# EAGLE design RAM (EAGLE 9.6.2)
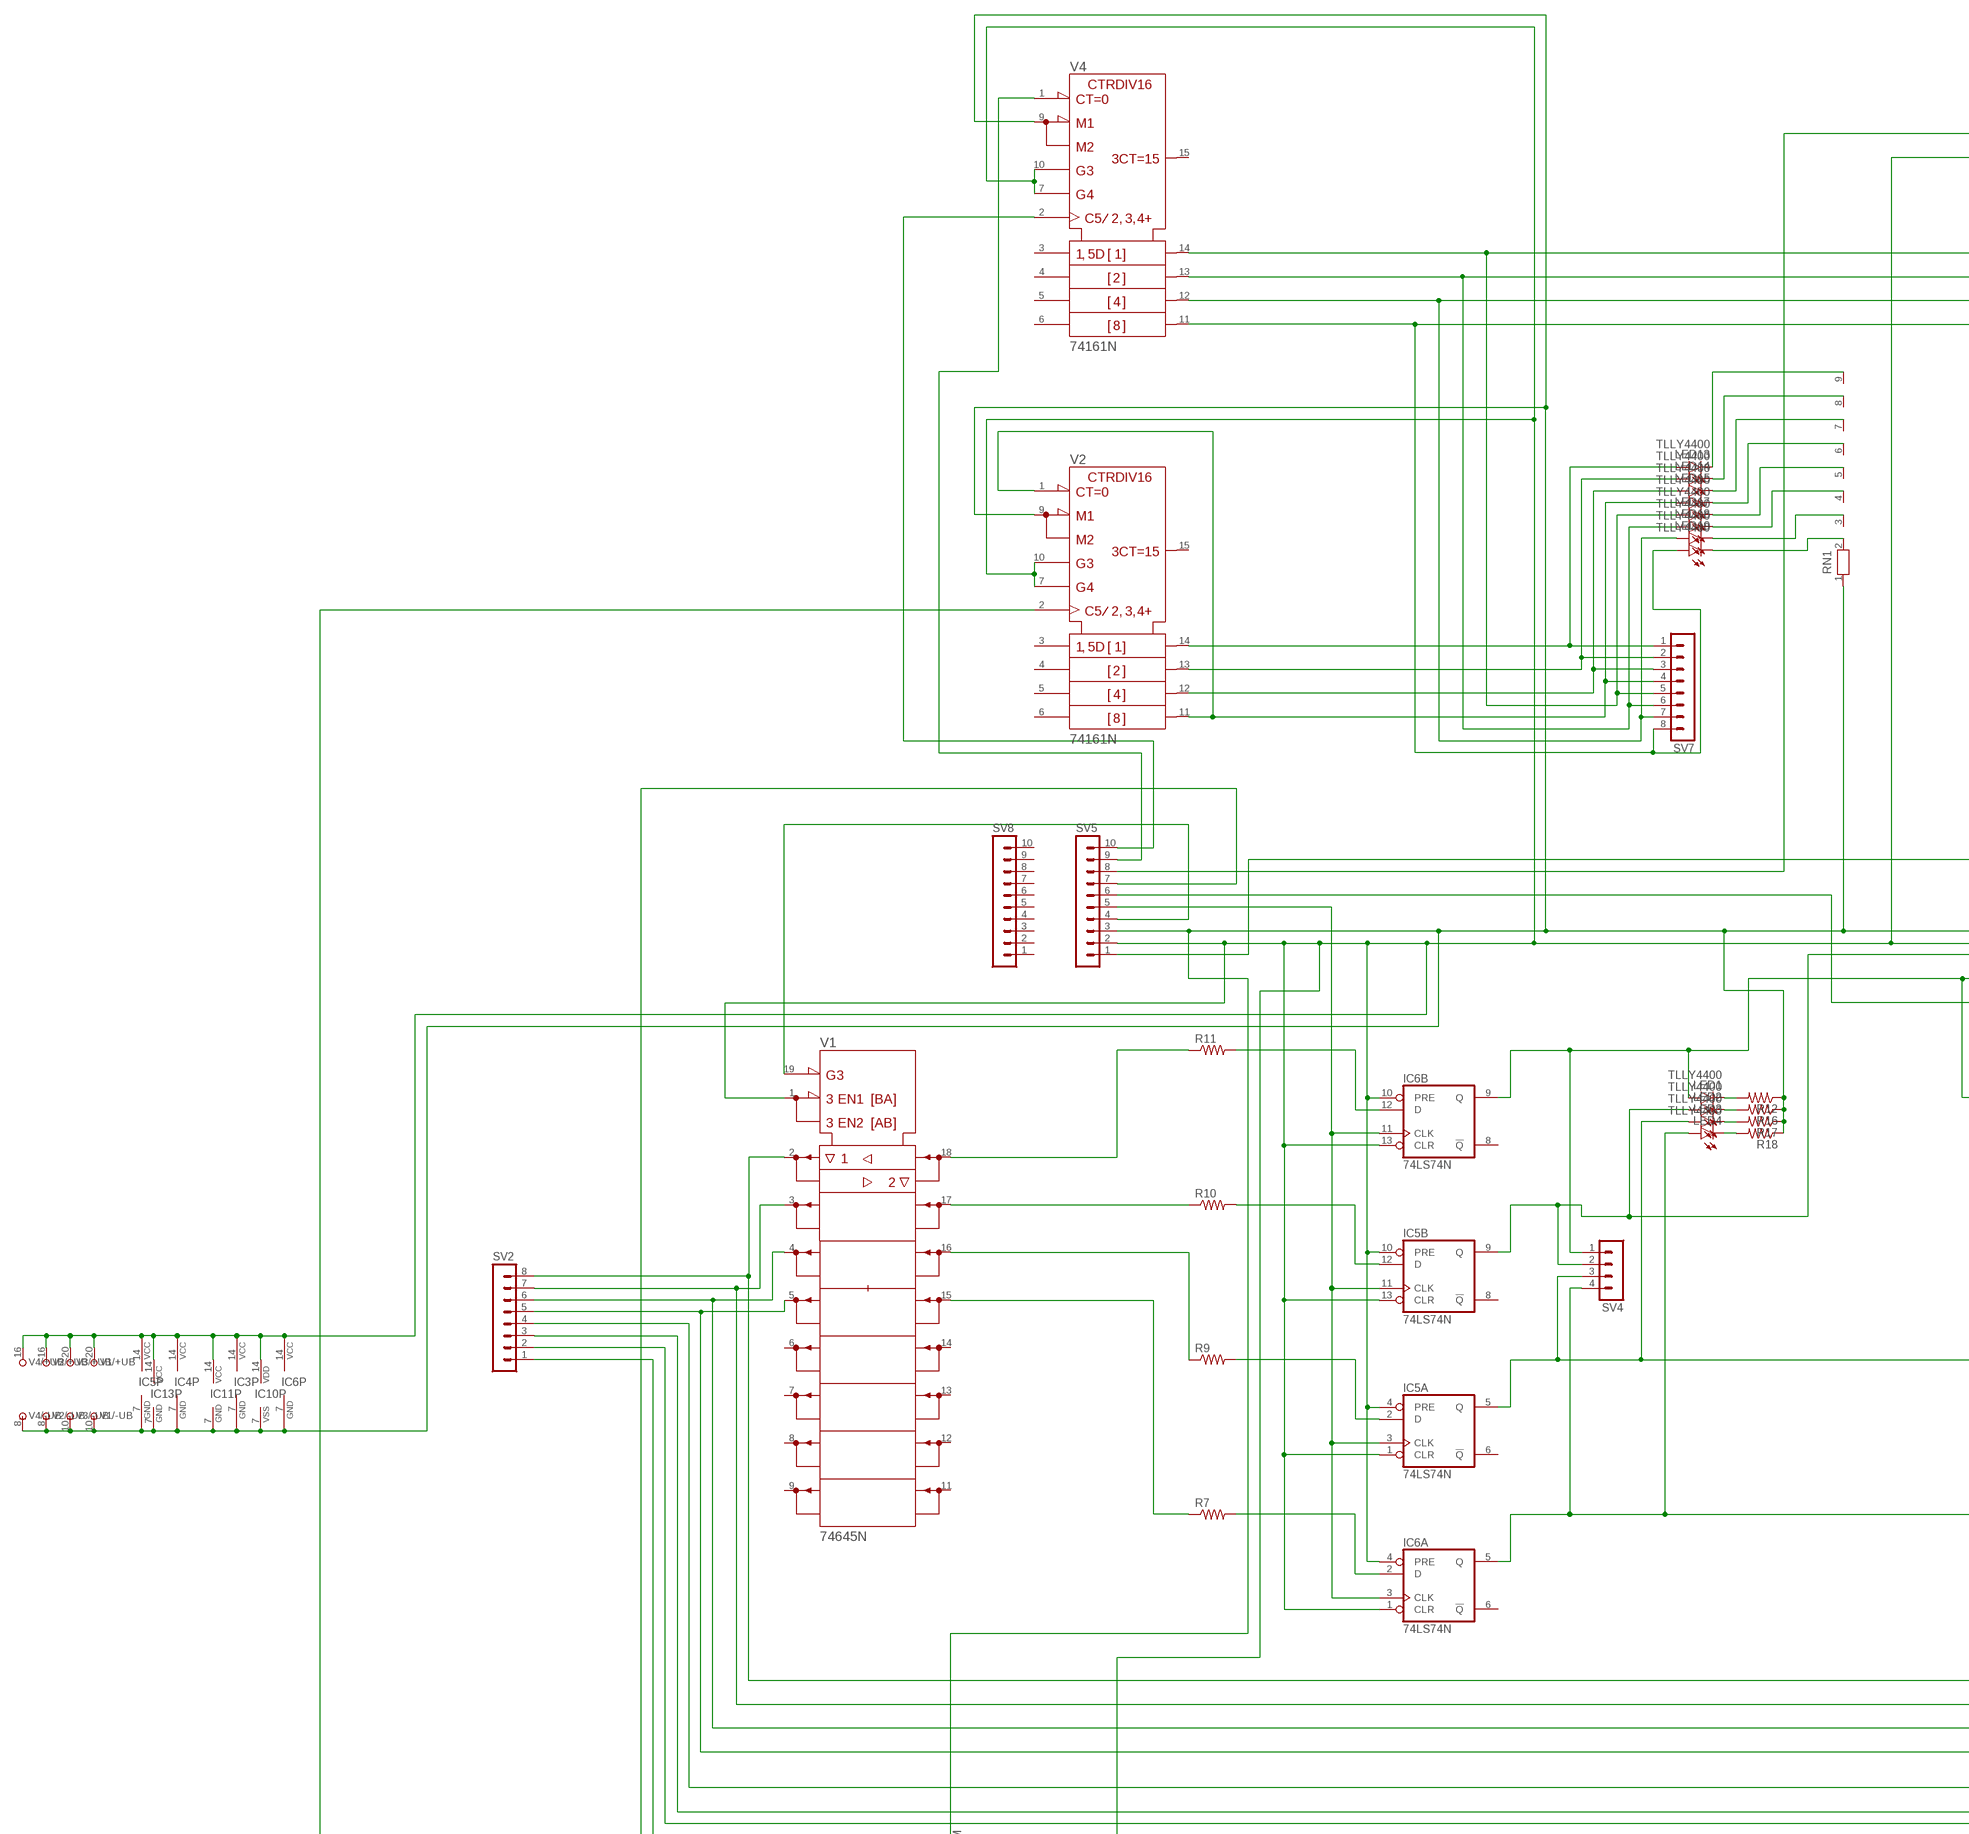
[diagram p0: schematic, sheet 1, part 1 of 3]
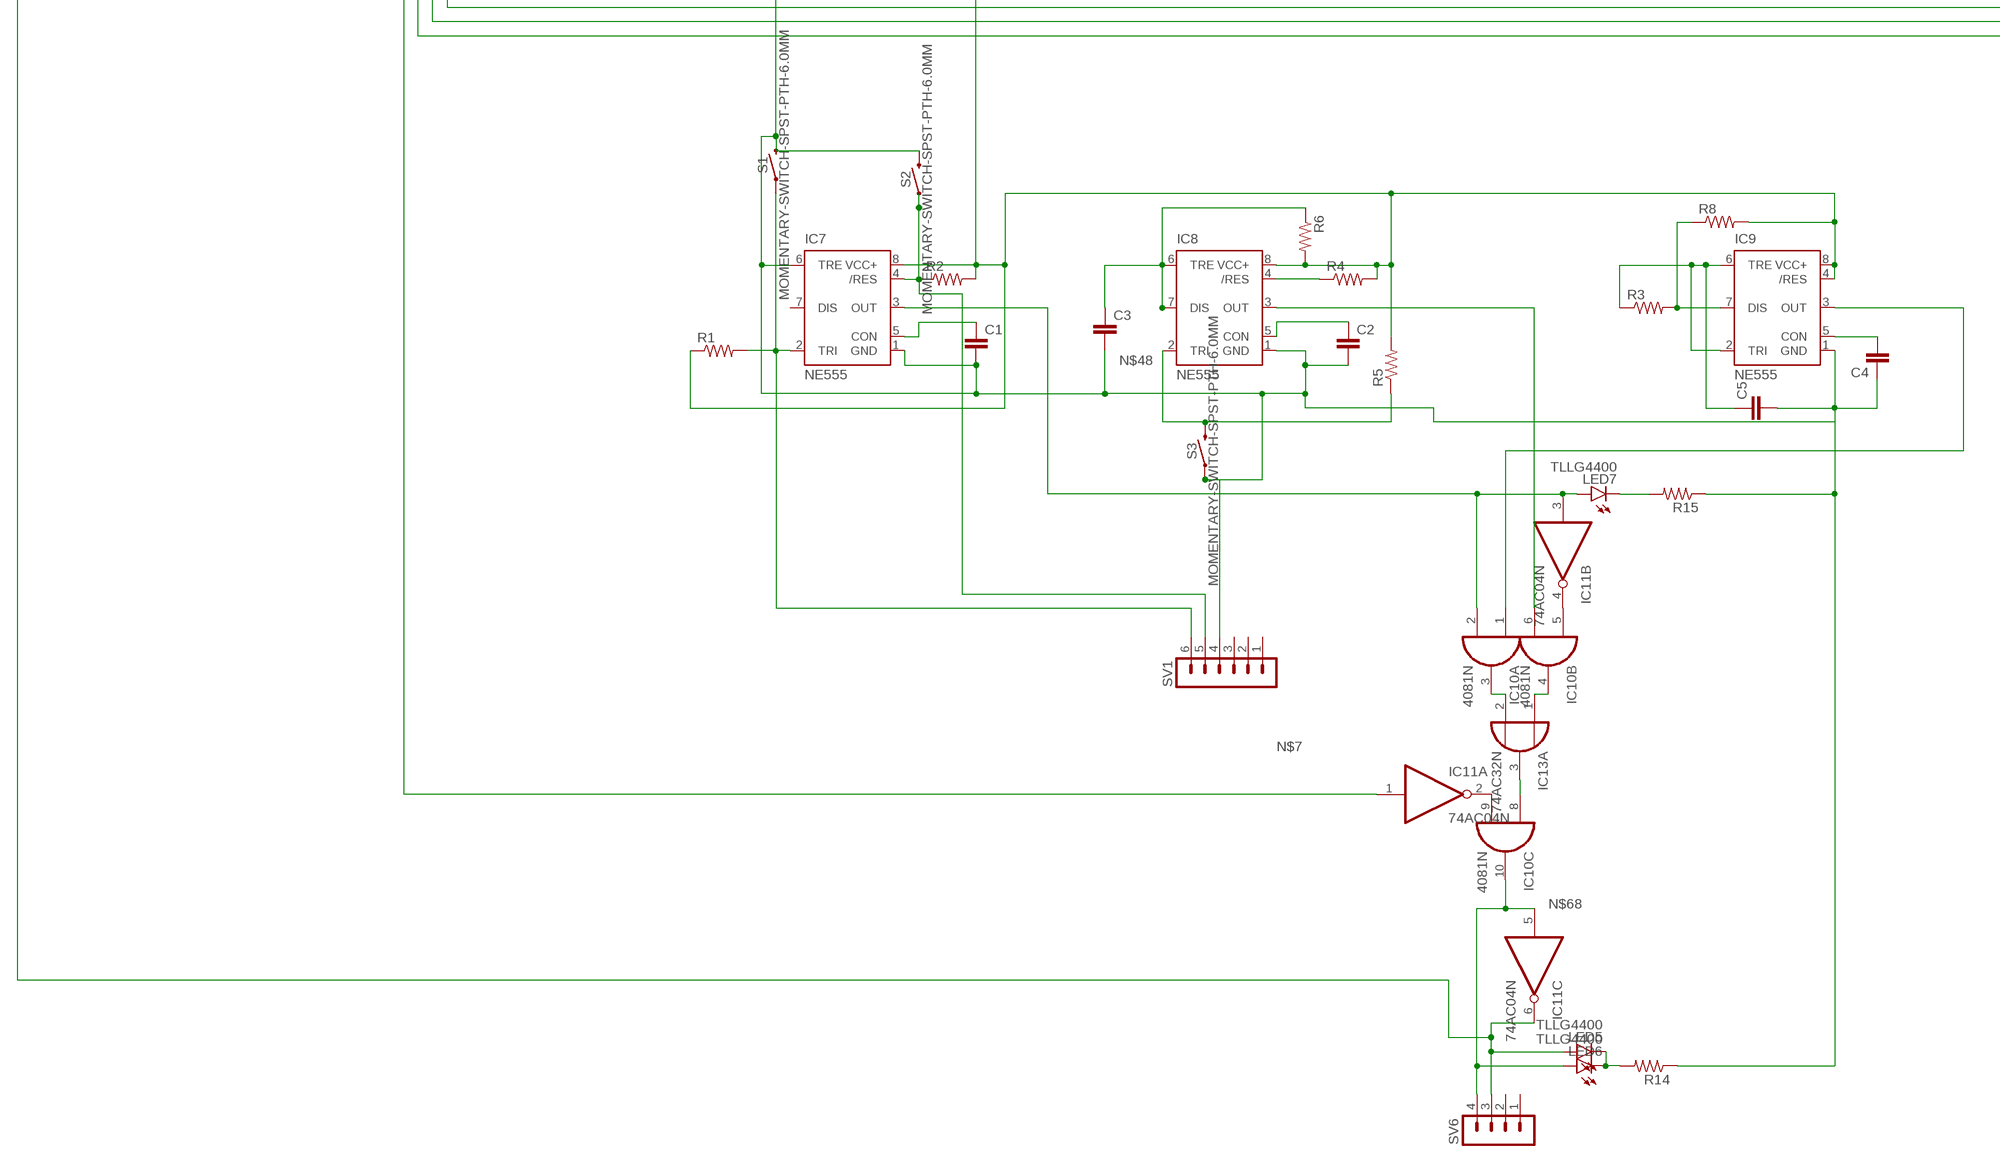
[diagram p1: schematic, sheet 1, part 2 of 3]
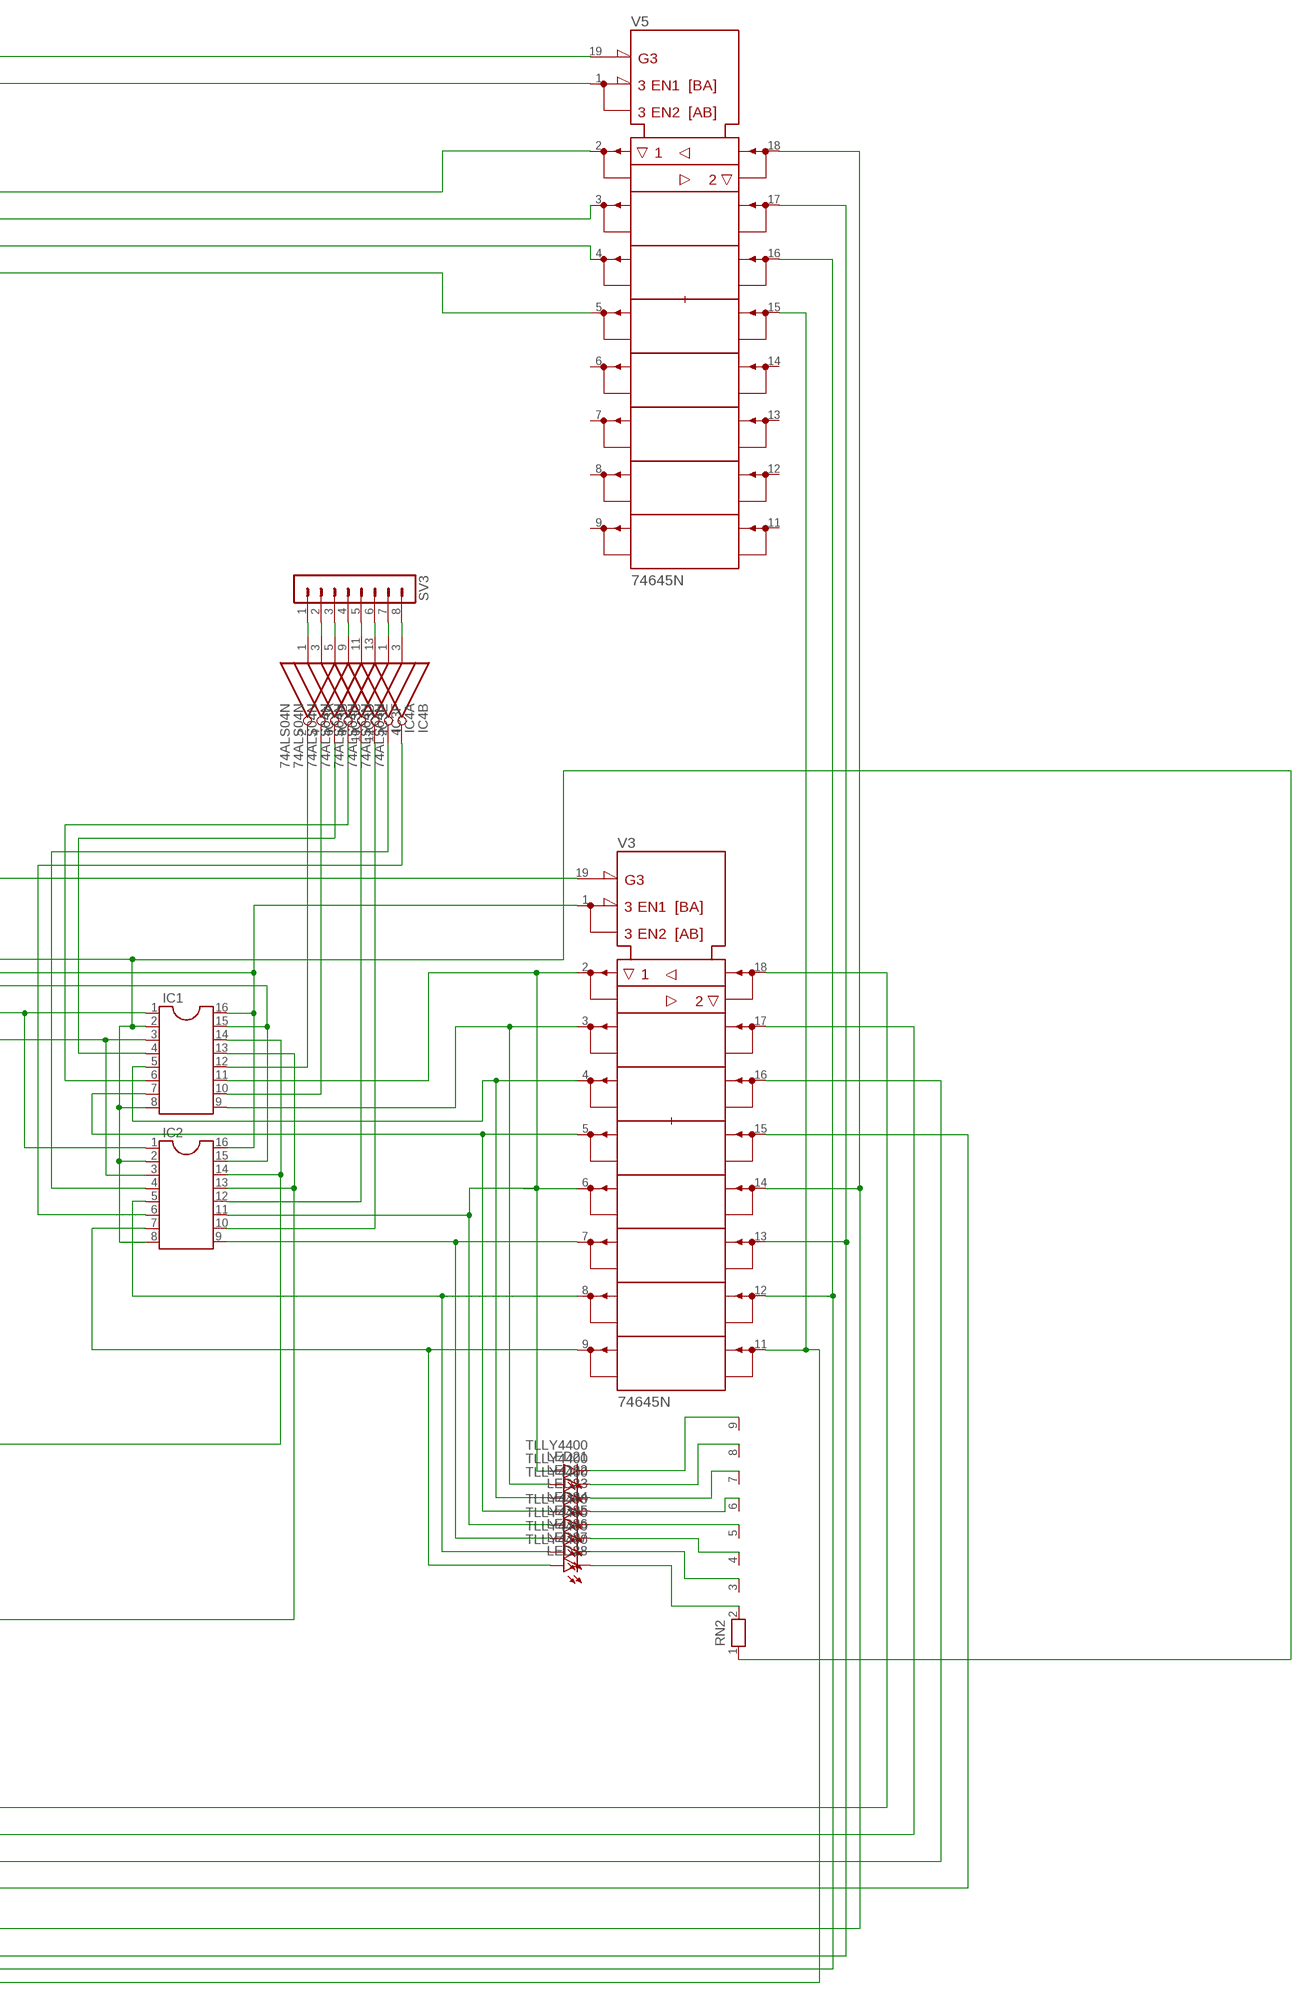
[diagram p2: schematic, sheet 1, part 3 of 3]

## Parts
C1  C2,5-3  [C2.5-3]
C2  C2,5-3  [C2.5-3]
C3  C2,5-3  [C2.5-3]
C4  C2,5-3  [C2.5-3]
C5  C2,5-3  [C2.5-3]
IC1  DIL16  [DIL16]
IC2  DIL16  [DIL16]
IC3  74ALS04N  [DIL14]
IC4  74ALS04N  [DIL14]
IC5  74LS74N  [DIL14]
IC6  74LS74N  [DIL14]
IC7  NE555  [DIL-08]
IC8  NE555  [DIL-08]
IC9  NE555  [DIL-08]
IC10  4081N  [DIL14]
IC11  74AC04N  [DIL14]
IC13  74AC32N  [DIL14]
LED1  TLLY4400  [LED3MM]
LED2  TLLY4400  [LED3MM]
LED3  TLLY4400  [LED3MM]
LED4  TLLY4400  [LED3MM]
LED5  TLLG4400  [LED3MM]
LED6  TLLG4400  [LED3MM]
LED7  TLLG4400  [LED3MM]
LED13  TLLY4400  [LED3MM]
LED14  TLLY4400  [LED3MM]
LED15  TLLY4400  [LED3MM]
LED16  TLLY4400  [LED3MM]
LED17  TLLY4400  [LED3MM]
LED18  TLLY4400  [LED3MM]
LED19  TLLY4400  [LED3MM]
LED20  TLLY4400  [LED3MM]
LED21  TLLY4400  [LED3MM]
LED22  TLLY4400  [LED3MM]
LED23  TLLY4400  [LED3MM]
LED24  TLLY4400  [LED3MM]
LED25  TLLY4400  [LED3MM]
LED26  TLLY4400  [LED3MM]
LED27  TLLY4400  [LED3MM]
LED28  TLLY4400  [LED3MM]
R1  R-US_0411/3V  [0411V]
R2  R-US_0411/3V  [0411V]
R3  R-US_0411/3V  [0411V]
R4  R-US_0411/3V  [0411V]
R5  R-US_0411/3V  [0411V]
R6  R-US_0411/3V  [0411V]
R7  R-US_0411/3V  [0411V]
R8  R-US_0411/3V  [0411V]
R9  R-US_0411/3V  [0411V]
R10  R-US_0411/3V  [0411V]
R11  R-US_0411/3V  [0411V]
R12  R-US_0411/3V  [0411V]
R14  R-US_0411/3V  [0411V]
R15  R-US_0411/3V  [0411V]
R16  R-US_0411/3V  [0411V]
R17  R-US_0411/3V  [0411V]
R18  R-US_0411/3V  [0411V]
RN1  RN08  [RN-9]
RN2  RN08  [RN-9]
S1  MOMENTARY-SWITCH-SPST-PTH-6.0MM  [TACTILE_SWITCH_PTH_6.0MM]
S2  MOMENTARY-SWITCH-SPST-PTH-6.0MM  [TACTILE_SWITCH_PTH_6.0MM]
S3  MOMENTARY-SWITCH-SPST-PTH-6.0MM  [TACTILE_SWITCH_PTH_6.0MM]
SV1  MA06-1  [MA06-1]
SV2  MA08-1  [MA08-1]
SV3  MA08-1  [MA08-1]
SV4  MA04-1  [MA04-1]
SV5  MA10-1  [MA10-1]
SV6  MA04-1  [MA04-1]
SV7  MA08-1  [MA08-1]
SV8  MA10-1  [MA10-1]
V1  74645N  [DIL20]
V2  74161N  [DIL16]
V3  74645N  [DIL20]
V4  74161N  [DIL16]
V5  74645N  [DIL20]

## Nets
N$1: LED28.K(C) RN2.2
N$2: IC1.10 IC3.4(B:O)
N$3: IC1.1 IC2.1 IC6.9(B:Q) LED1.A SV4.1
N$4: IC1.15 IC2.15 IC5.9(B:Q) LED2.A SV4.2
N$5: C1.1 IC7.5(CON)
N$6: LED19.A SV7.7 V4.12(QC) V5.4(A3)
N$7: IC11.1(A:I) SV5.7
N$8: IC7.2(TRI) R1.2 S1.1 SV1.6
N$9: IC1.4 IC3.6(C:O)
N$10: SV2.8 V1.2(A1) V3.18(B1)
N$11: IC1.3 IC2.3 SV5.6
N$12: IC1.5 LED23.A V3.4(A3)
N$13: IC1.7 LED24.A V3.5(A4)
N$14: IC2.4 IC4.2(A:O)
N$15: IC2.10 IC3.12(F:O)
N$16: IC2.5 LED27.A V3.8(A7)
N$17: IC2.7 LED28.A V3.9(A8)
N$18: IC1.11 IC2.11 LED21.A LED25.A V3.2(A1)
N$19: IC5.3(A:CLK) IC5.11(B:CLK) IC6.3(A:CLK) IC6.11(B:CLK) SV5.5
N$20: IC1.9 LED22.A V3.3(A2)
N$21: IC1.6 IC3.8(D:O)
N$22: R10.1 V1.17(B2)
N$23: IC2.12 IC3.10(E:O)
N$24: R11.1 V1.18(B1)
N$25: R7.1 V1.15(B4)
N$26: V3.6(A5)
N$27: IC6.12(B:D) R11.2
N$28: IC1.13 IC2.13 IC6.5(A:Q) LED4.A SV4.4
N$29: IC2.6 IC4.4(B:O)
N$30: LED18.K(C) RN1.4
N$31: LED20.K(C) RN1.2
N$32: SV5.1 V3.19(!G)
N$33: IC3.1(A:I) SV3.1
N$34: IC3.3(B:I) SV3.2
N$35: IC3.5(C:I) SV3.3
N$36: IC3.9(D:I) SV3.4
N$37: IC3.11(E:I) SV3.5
N$38: C1.2 C2.2 C3.2 C4.1 C5.2 IC1.2 IC1.8 IC2.2 IC2.8 IC3.7(P:GND) IC4.7(P:GND) IC5.7(P:GND) IC6.7(P:GND) IC7.1(GND) IC7.6(TRE) IC8.1(GND) IC9.1(GND) IC10.7(P:VSS) IC11.7(P:GND) IC13.7(P:GND) R12.1 R14.1 R15.1 R16.1 R17.1 R18.1 RN1.1 RN2.1 S1.3 S2.3 S3.1 SV1.4 SV5.3 V1.10(-UB) V2.8(-UB) V2.9(!LOAD) V3.10(-UB) V4.8(-UB) V4.9(!LOAD)
N$39: IC3.13(F:I) SV3.6
N$40: C3.1 IC8.6(TRE) IC8.7(DIS) R6.1
N$41: IC4.1(A:I) SV3.7
N$42: IC4.3(B:I) SV3.8
N$43: IC7.4(/RES) R2.1 S2.1 SV1.5
N$44: IC7.3(OUT) IC10.2(A:I1) IC11.3(B:I) LED7.A
N$45: C2.1 IC8.5(CON)
N$46: SV5.4 V1.19(!G)
N$47: IC10.4(B:O) IC13.1(A:I0)
N$48: IC8.2(TRI) R5.1 S3.3
N$49: R9.1 V1.16(B3)
N$50: SV2.1 V3.11(B8) V5.15(B4)
N$51: SV2.2 V3.12(B7) V5.16(B3)
N$52: SV2.3 V3.13(B6) V5.17(B2)
N$53: SV2.4 V3.14(B5) V5.18(B1)
N$54: LED18.A SV7.6 V4.13(QB) V5.3(A2)
N$55: LED20.A SV7.8 V4.11(QD) V5.5(A4)
N$56: LED17.A SV7.5 V4.14(QA) V5.2(A1)
N$57: SV5.8 V5.19(!G)
N$58: IC8.3(OUT) IC10.6(B:I1)
N$59: C5.1 IC9.2(TRI) IC9.6(TRE) R3.1
N$60: IC1.14 IC2.14 IC5.5(A:Q) LED3.A SV4.3
N$61: IC9.7(DIS) R3.2 R8.1
N$62: C4.2 IC9.5(CON)
N$63: LED5.K(C) LED6.K(C) R14.2
N$64: IC9.3(OUT) IC10.1(A:I0)
N$65: IC10.9(C:I1) IC11.2(A:O)
N$66: IC10.5(B:I0) IC11.4(B:O)
N$67: IC11.6(C:O) LED5.A SV6.3 V2.2(CLK)
N$68: IC10.10(C:O) IC11.5(C:I) LED6.A SV6.4
N$69: SV2.7 V1.3(A2) V3.17(B2)
N$70: LED13.A SV7.1 V2.14(QA)
N$71: LED14.A SV7.2 V2.13(QB)
N$72: LED15.A SV7.3 V2.12(QC)
N$73: LED16.A SV7.4 V2.1(!CLR) V2.11(QD)
N$74: IC10.8(C:I0) IC13.3(A:O)
N$75: SV2.6 V1.4(A3) V3.16(B3)
N$76: IC10.3(A:O) IC13.2(A:I1)
N$77: SV2.5 V1.5(A4) V3.15(B4)
N$78: IC1.16 IC2.16 IC3.14(P:VCC) IC4.14(P:VCC) IC5.1(A:CLR) IC5.4(A:PRE) IC5.10(B:PRE) IC5.13(B:CLR) IC5.14(P:VCC) IC6.1(A:CLR) IC6.4(A:PRE) IC6.10(B:PRE) IC6.13(B:CLR) IC6.14(P:VCC) IC7.8(VCC+) IC8.8(VCC+) IC9.4(/RES) IC9.8(VCC+) IC10.14(P:VDD) IC11.14(P:VCC) IC13.14(P:VCC) R1.1 R2.2 R4.2 R5.2 R6.2 R8.2 SV5.2 V1.1(DIR) V1.20(+UB) V2.7(ENP) V2.10(ENT) V2.16(+UB) V3.1(DIR) V3.20(+UB) V4.7(ENP) V4.10(ENT) V4.16(+UB) V5.1(DIR)
N$79: IC8.4(/RES) R4.1
N$80: LED19.K(C) RN1.3
N$81: SV5.9 V4.1(!CLR)
N$82: SV5.10 V4.2(CLK)
N$83: IC1.12 IC3.2(A:O)
N$84: IC2.9 LED26.A V3.7(A6)
N$85: LED17.K(C) RN1.5
N$86: LED16.K(C) RN1.6
N$87: LED15.K(C) RN1.7
N$88: LED14.K(C) RN1.8
N$89: LED13.K(C) RN1.9
N$90: LED7.K(C) R15.2
N$91: LED27.K(C) RN2.3
N$92: LED26.K(C) RN2.4
N$93: LED25.K(C) RN2.5
N$94: LED24.K(C) RN2.6
N$95: LED23.K(C) RN2.7
N$96: LED22.K(C) RN2.8
N$97: LED21.K(C) RN2.9
N$98: LED1.K(C) R12.2
N$99: LED2.K(C) R16.2
N$100: LED3.K(C) R17.2
N$101: LED4.K(C) R18.2
N$102: IC5.12(B:D) R10.2
N$103: IC5.2(A:D) R9.2
N$104: IC6.2(A:D) R7.2
Unconnected: IC4.5(C:I) IC4.6(C:O) IC4.8(D:O) IC4.9(D:I) IC4.10(E:O) IC4.11(E:I) IC4.12(F:O) IC4.13(F:I) IC5.6(A:!Q) IC5.8(B:!Q) IC6.6(A:!Q) IC6.8(B:!Q) IC7.7(DIS) IC10.11(D:O) IC10.12(D:I0) IC10.13(D:I1) IC11.8(D:O) IC11.9(D:I) IC11.10(E:O) IC11.11(E:I) IC11.12(F:O) IC11.13(F:I) IC13.4(B:I0) IC13.5(B:I1) IC13.6(B:O) IC13.8(C:O) IC13.9(C:I0) IC13.10(C:I1) IC13.11(D:O) IC13.12(D:I0) IC13.13(D:I1) SV1.1 SV1.2 SV1.3 SV6.1 SV6.2 SV8.1 SV8.2 SV8.3 SV8.4 SV8.5 SV8.6 SV8.7 SV8.8 SV8.9 SV8.10 V1.6(A5) V1.7(A6) V1.8(A7) V1.9(A8) V1.11(B8) V1.12(B7) V1.13(B6) V1.14(B5) V2.3(A) V2.4(B) V2.5(C) V2.6(D) V2.15(RCO) V4.3(A) V4.4(B) V4.5(C) V4.6(D) V4.15(RCO) V5.6(A5) V5.7(A6) V5.8(A7) V5.9(A8) V5.11(B8) V5.12(B7) V5.13(B6) V5.14(B5)

## Power pins joined to a net without a drawn wire
+UB: V5.20(+UB)
-UB: V5.10(-UB)

## Library data of the parts
C1-C5 = capacitor-wima:C: CAPACITOR naming: grid - package width
IC1 IC2 = ic-package:DIL16: Dual In Line / Socket
IC3 IC4 = 74xx-us:74*04: Hex INVERTER
IC5 IC6 = 74xx-us:74*74: Dual D type positive edge triggered FLIP FLOP, preset and clear
IC7-IC9 = st-microelectronics:NE555: General purpose bipolar Timer; MF: Arrow Electronics; MPN: NE555N; OC_FARNELL: 1467742; OC_NEWARK: 89K1486
IC10 = 40xx:4081: Quad 2-input AND
IC11 = 74xx-eu:74*04: Hex INVERTER
IC13 = 74xx-eu:74*32: Quad 2-input OR gate
LED1-LED4 LED13-LED28 = led:TLLY4400: Low Current (2mA) LED 3 mm Tinted Diffused Package color YELLOW Source: Data sheet <http://www.farnell.com/datasheets/391098.pdf>; MF: VISHAY SEMICONDUCTOR; OC_FARNELL: 1612439
LED5-LED7 = led:TLLG4400: Low Current (2mA) LED 3 mm Tinted Diffused Package color GREEN Source: Data sheet <http://www.farnell.com/datasheets/391098.pdf>; MF: VISHAY SEMICONDUCTOR; OC_FARNELL: 1612435
R1-R12 R14-R18 = rcl:R-US_: RESISTOR, American symbol; SPICEPREFIX: R
RN1 RN2 = resistor-net:RN08: RESISTOR NETWORK; OC_FARNELL: unknown; OC_NEWARK: unknown
S1-S3 = SparkFun-Switches:MOMENTARY-SWITCH-SPST: Momentary Switch (Pushbutton) - SPST Normally-open (NO) SPST momentary switches (buttons, pushbuttons). Variants PTH-12MM - 12mm square, through-hole Momentary Pushbutton Switch - 12mm Square <https://www.sparkfun.com/products/9190> (COM-09190) PTH-6.0MM, PTH-6.0MM-KIT - 6.0mm square, through-hole Mini Pushbutton Switch <https://www.sparkfun.com/products/97> (COM-00097) KIT package intended for soldering kit's - only one side of pads' copper is exposed. PTH-RIGHT-ANGLE-KIT - Right-angle, through-hole Right Angle Tactile Button <https://www.sparkfun.com/products/10791> - Used on SparkFun BigTime Watch Kit <https://www.sparkfun.com/products/11734> SMD-12MM - 12mm square, surface-mount Tactile Button - SMD (12mm) <https://www.sparkfun.com/products/12993> (COM-12993) Used on SparkFun PicoBoard <https://www.sparkfun.com/products/11888> SMD-4.5MM - 4.5mm Square Trackball Switch Used on SparkFun Blackberry Trackballer Breakout <https://www.sparkfun.com/products/13169> SMD-4.6MMX2.8MM - 4.60mm x 2.80mm, surface mount Used on SparkFun SAMD21 Mini Breakout <https://www.sparkfun.com/products/13664> SMD-5.2MM, SMD-5.2-REDUNDANT - 5.2mm square, surface-mount Mini Pushbutton Switch - SMD <https://www.sparkfun.com/products/8720> (COM-08720) Used on Arduino Pro Mini <https://www.sparkfun.com/products/11114> REDUNDANT package connects both switch circuits together SMD-6.0X3.5MM - 6.0 x 3.5mm, surface mount Momentary Reset Switch SMD <https://www.sparkfun.com/products/8229> (COM-08229) SMD-6.2MM-TALL - 6.2mm square, surface mount Tactile Button - SMD (6mm) <https://www.sparkfun.com/products/12992> Used on SparkFun Digital Sandbox <https://www.sparkfun.com/products/12651> SMD-RIGHT-ANGLE - Right-angle, surface mount Used on SparkFun Block for Intel® Edison - Arduino <https://www.sparkfun.com/products/13036>; PROD_ID: SWCH-08441; SF_SKU: COM-00097
SV1 = con-lstb:MA06-1: PIN HEADER; OC_FARNELL: unknown; OC_NEWARK: unknown
SV2 SV3 SV7 = con-lstb:MA08-1: PIN HEADER; OC_FARNELL: unknown; OC_NEWARK: unknown
SV4 SV6 = con-lstb:MA04-1: PIN HEADER; OC_FARNELL: unknown; OC_NEWARK: unknown
SV5 SV8 = con-lstb:MA10-1: PIN HEADER; OC_FARNELL: unknown; OC_NEWARK: unknown
V1 V3 V5 = 74ttl-din:74*645: Octal bus TRANSCEIVER 3-state
V2 V4 = 74ttl-din:74*161: Synchrounus 4-bit COUNTER

## Net classes
0 default: width 0.381 mm, drill 0.508 mm, clearance 0.254 mm

## Board
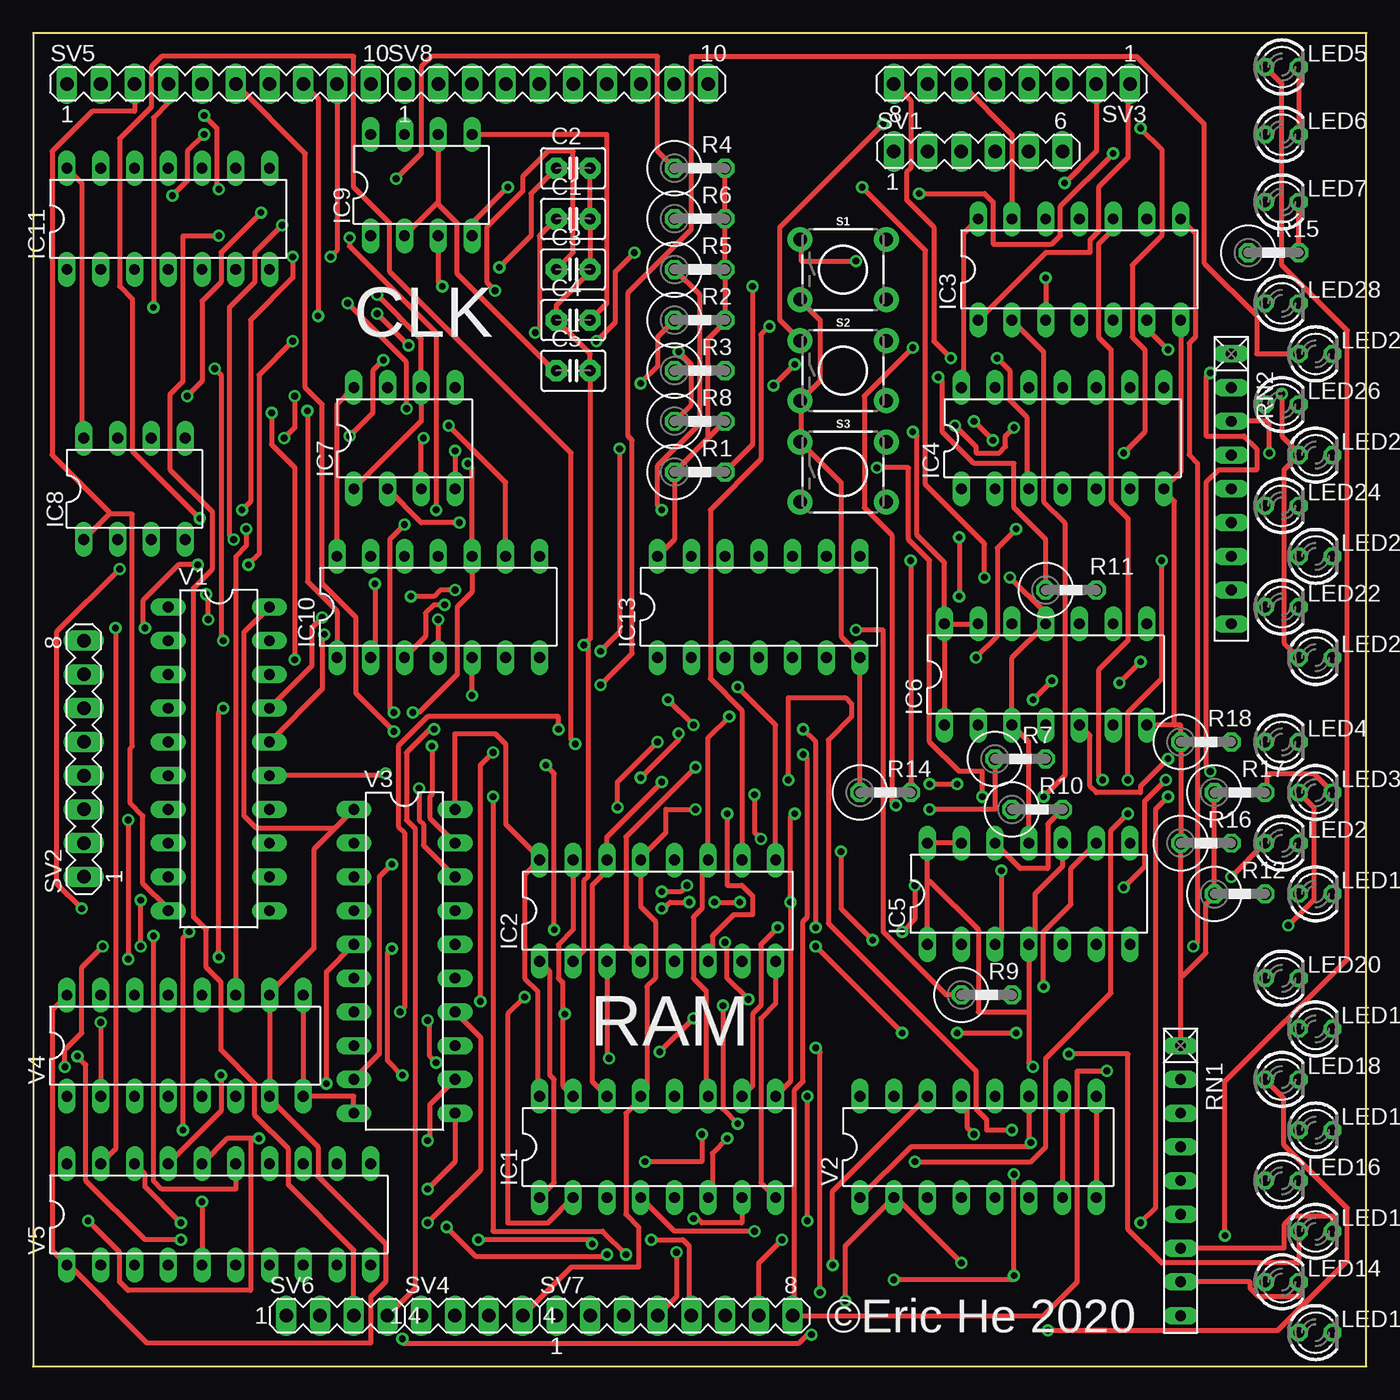
[diagram p3: board, top side]
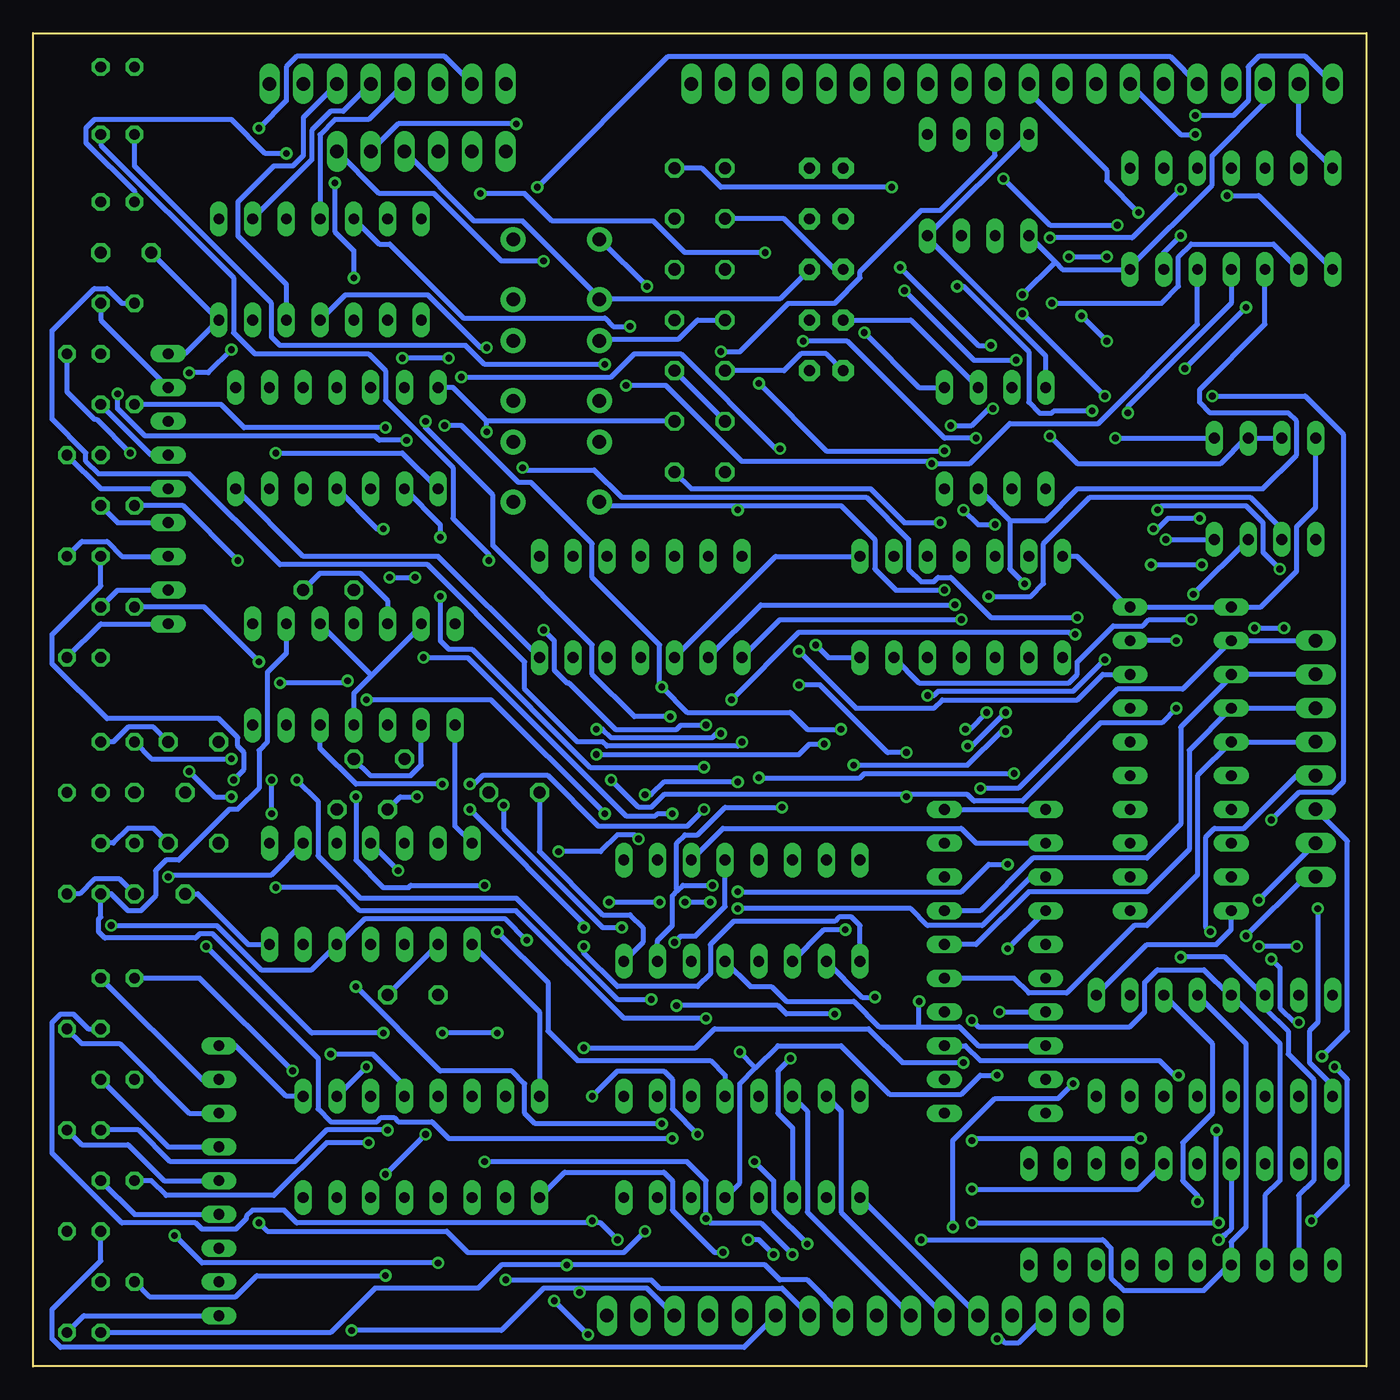
[diagram p4: board, bottom side, seen from below]

Size 100.33 x 100.33 mm. Coordinates in mm from the lower left corner, seen from the top.
Outline: 0,0 100.33,0 100.33,100.33 0,100.33 0,0
Copper layers (1*16): Top 0.035mm / dielectric 1.5mm / Bottom 0.035mm
Design rules "default": minimum track width 6mil, minimum drill 0.35mm, track to track 6mil, track to pad 6mil, pad to pad 6mil, via to via 6mil, smd to smd 6mil, copper to edge 40mil, drill to drill 6mil, minimum pad ring 10mil, minimum via ring 8mil, stop-mask expansion 4mil, vias tented up to drill 0mil, thermal gap 10mil

### Footprints (pad centres in the part's own frame; a part is rotated, then mirrored left to right if it is on the bottom)
C2.5-3 = drill 0.813 pad 1.6 octagon: 1 -1.27,0; 2 1.27,0
DIL16 = drill 0.813 long: 1 -8.89,-3.81; 2 -6.35,-3.81; 3 -3.81,-3.81; 4 -1.27,-3.81; 5 1.27,-3.81; 6 3.81,-3.81; 7 6.35,-3.81; 8 8.89,-3.81; 9 8.89,3.81; 10 6.35,3.81; 11 3.81,3.81; 12 1.27,3.81; 13 -1.27,3.81; 14 -3.81,3.81; 15 -6.35,3.81; 16 -8.89,3.81
DIL14 = drill 0.813 long: 1 -7.62,-3.81; 2 -5.08,-3.81; 3 -2.54,-3.81; 4 0,-3.81; 5 2.54,-3.81; 6 5.08,-3.81; 7 7.62,-3.81; 8 7.62,3.81; 9 5.08,3.81; 10 2.54,3.81; 11 0,3.81; 12 -2.54,3.81; 13 -5.08,3.81; 14 -7.62,3.81
DIL-08 = drill 0.813 long: 1 -3.81,-3.81; 2 -1.27,-3.81; 3 1.27,-3.81; 4 3.81,-3.81; 5 3.81,3.81; 6 1.27,3.81; 7 -1.27,3.81; 8 -3.81,3.81
LED3MM = drill 0.813 octagon: A -1.27,0; K 1.27,0
0411V = drill 0.914 octagon: 1 -2.54,0; 2 1.27,0
RN-9 = drill 0.813 long: 1 -10.16,0; 2 -7.62,0; 3 -5.08,0; 4 -2.54,0; 5 0,0; 6 2.54,0; 7 5.08,0; 8 7.62,0; 9 10.16,0
TACTILE_SWITCH_PTH_6.0MM = drill 1.016 pad 1.88: 1 -3.251,2.261; 2 3.251,2.261; 3 -3.251,-2.261; 4 3.251,-2.261
MA06-1 = drill 1.016 long: 1 -6.35,0; 2 -3.81,0; 3 -1.27,0; 4 1.27,0; 5 3.81,0; 6 6.35,0
MA08-1 = drill 1.016 long: 1 -8.89,0; 2 -6.35,0; 3 -3.81,0; 4 -1.27,0; 5 1.27,0; 6 3.81,0; 7 6.35,0; 8 8.89,0
MA04-1 = drill 1.016 long: 1 -3.81,0; 2 -1.27,0; 3 1.27,0; 4 3.81,0
MA10-1 = drill 1.016 long: 1 -11.43,0; 2 -8.89,0; 3 -6.35,0; 4 -3.81,0; 5 -1.27,0; 6 1.27,0; 7 3.81,0; 8 6.35,0; 9 8.89,0; 10 11.43,0
DIL20 = drill 0.813 long: 1 -11.43,-3.81; 2 -8.89,-3.81; 3 -6.35,-3.81; 4 -3.81,-3.81; 5 -1.27,-3.81; 6 1.27,-3.81; 7 3.81,-3.81; 8 6.35,-3.81; 9 8.89,-3.81; 10 11.43,-3.81; 11 11.43,3.81; 12 8.89,3.81; 13 6.35,3.81; 14 3.81,3.81; 15 1.27,3.81; 16 -1.27,3.81; 17 -3.81,3.81; 18 -6.35,3.81; 19 -8.89,3.81; 20 -11.43,3.81

### Placement (x,y rotation side)
C1  40.64,86.36 0 top
C2  40.64,90.17 0 top
C3  40.64,82.55 0 top
C4  40.64,78.74 0 top
C5  40.64,74.93 0 top
IC1  46.99,16.51 0 top
IC2  46.99,34.29 0 top
IC3  78.74,82.55 0 top
IC4  77.47,69.85 0 top
IC5  74.93,35.56 0 top
IC6  76.2,52.07 0 top
IC7  27.94,69.85 0 top
IC8  7.62,66.04 0 top
IC9  29.21,88.9 0 top
IC10  30.48,57.15 0 top
IC11  10.16,86.36 0 top
IC13  54.61,57.15 0 top
LED1  96.52,35.56 0 top
LED2  93.98,39.37 0 top
LED3  96.52,43.18 0 top
LED4  93.98,46.99 0 top
LED5  93.98,97.79 0 top
LED6  93.98,92.71 0 top
LED7  93.98,87.63 0 top
LED13  96.52,2.54 0 top
LED14  93.98,6.35 0 top
LED15  96.52,10.16 0 top
LED16  93.98,13.97 0 top
LED17  96.52,17.78 0 top
LED18  93.98,21.59 0 top
LED19  96.52,25.4 0 top
LED20  93.98,29.21 0 top
LED21  96.52,53.34 0 top
LED22  93.98,57.15 0 top
LED23  96.52,60.96 0 top
LED24  93.98,64.77 0 top
LED25  96.52,68.58 0 top
LED26  93.98,72.39 0 top
LED27  96.52,76.2 0 top
LED28  93.98,80.01 0 top
R1  50.8,67.31 0 top
R2  50.8,78.74 0 top
R3  50.8,74.93 0 top
R4  50.8,90.17 0 top
R5  50.8,82.55 0 top
R6  50.8,86.36 0 top
R7  74.93,45.72 0 top
R8  50.8,71.12 0 top
R9  72.39,27.94 0 top
R10  76.2,41.91 0 top
R11  78.74,58.42 0 top
R12  91.44,35.56 0 top
R14  64.77,43.18 0 top
R15  93.98,83.82 0 top
R16  88.9,39.37 0 top
R17  91.44,43.18 0 top
R18  88.9,46.99 0 top
RN1  86.36,13.97 270 top
RN2  90.17,66.04 270 top
S1  60.96,82.55 0 top
S2  60.96,74.93 0 top
S3  60.96,67.31 0 top
SV1  71.12,91.44 0 top
SV2  3.81,45.72 90 top
SV3  73.66,96.52 180 top
SV4  33.02,3.81 0 top
SV5  13.97,96.52 0 top
SV6  22.86,3.81 0 top
SV7  48.26,3.81 0 top
SV8  39.37,96.52 0 top
V1  13.97,45.72 270 top
V2  71.12,16.51 0 top
V3  27.94,30.48 270 top
V4  11.43,24.13 0 top
V5  13.97,11.43 0 top

### Tracks (layer width: path | path; a pad name or v marks a point on that pad's centre or on a via)
N$1
  Bottom 0.381: RN2.2 95.25,78.74 LED28.K
N$2  (via drill 0.51)
  Top 0.381: IC1.10 54.13,21.11 54.13,26.51 54.77,27.15 54.77,31.75 v56.04,33.02 | v64.93,42.23 64.61,42.55 64.61,62.55 62.55,64.61 62.55,73.03 v66.2,76.68
  Bottom 0.381: v56.04,33.02 57.47,33.02 64.93,40.48 v64.93,42.23 | v66.2,76.68 66.67,76.68 70.64,80.64 76.83,80.64 IC3.4
N$3  (via drill 0.51)
  Top 0.381: IC2.1 38.89,29.69 38.89,21.91 39.21,21.59 39.21,13.81 IC1.1 | v69.53,25.08 v73.98,25.08 | v58.9,31.59 v65.41,25.08
  Bottom 0.381: IC6.9 81.28,53.66 82.71,52.23 82.71,46.99 83.34,46.35 83.34,43.5 84.93,41.91 85.57,41.91 89.38,38.1 90.33,38.1 91.12,37.31 91.12,35.4 92.23,34.29 93.19,34.29 94.46,35.56 LED1.A 95.25,33.81 95.41,33.66 95.41,32.7 94.93,32.23 88.11,32.23 87.79,32.54 86.84,32.54 79.38,25.08 v73.98,25.08 | SV4.1 IC1.1 | v65.41,25.08 v69.53,25.08 | v58.9,31.59 58.9,31.11 56.36,28.57 50.32,28.57 49.37,29.53 49.37,31.75 47.62,33.5 40.01,33.5 39.69,33.81 38.73,33.81 38.1,33.18 IC2.1
N$4  (via drill 0.51)
  Top 0.381: LED2.A v90.17,36.83 | IC1.15 39.85,21.11 39.85,26.51 | 39.85,26.51 39.85,28.89 39.53,29.21 39.53,31.75 40.64,32.86 IC2.15 | IC5.9 78.11,37.47 78.11,34.77 76.04,32.7 v76.04,28.57 | v53.02,18.26 51.91,19.37 v51.91,27.15 | v40.01,26.51 39.85,26.51
  Bottom 0.381: IC5.9 82.39,36.99 90.01,36.99 v90.17,36.83 | SV4.2 39.53,11.59 39.53,19.21 IC1.15 | v76.04,28.57 69.69,22.23 64.29,22.23 63.34,21.27 63.34,19.05 62.55,18.26 v53.02,18.26 | v51.91,27.15 44.29,27.15 43.66,26.51 v40.01,26.51
N$5  (via drill 0.51)
  Top 0.381: v37.78,77.79 38.1,78.11 38.1,85.09 C1.1
  Bottom 0.381: IC7.5 33.66,73.66 v37.78,77.79
N$6  (via drill 0.51)
  Top 0.381: v56.36,9.53 54.61,7.78 SV7.7 | v33.5,9.53 42.07,9.53 v42.07,9.21 | v46.04,15.4 50.32,15.4 v50.32,17.46 | v58.26,10.95 v58.26,20.32
  Bottom 0.381: V4.12 9.05,24.29 9.05,10.48 10.16,9.37 V5.4 10.32,7.62 12.22,5.71 18.26,5.71 19.21,6.67 19.21,8.89 19.84,9.53 v33.5,9.53 | LED19.A 96.2,25.4 97.31,26.51 98.27,26.51 98.9,25.88 98.9,16.03 93.66,10.79 88.11,10.79 87.63,10.32 85.09,10.32 84.3,11.11 84.3,11.27 83.82,11.75 81.44,11.75 80.49,10.79 58.26,10.79 | 58.26,10.79 57.63,10.79 v56.36,9.53 | v42.07,9.21 44.61,11.75 44.61,13.97 v46.04,15.4 | v50.32,17.46 52.23,19.37 52.23,21.59 52.86,22.23 56.36,22.23 v58.26,20.32 | v58.26,10.95 58.26,10.79
N$7  (via drill 0.51)
  Top 0.381: v10.48,88.11 11.59,89.22 11.59,91.44 v12.86,92.71
  Bottom 0.381: IC11.1 8.1,88.11 v10.48,88.11 | v12.86,92.71 13.97,92.71 SV5.7
N$8  (via drill 0.51)
  Top 0.381: IC7.2 29.21,63.5 v32.07,63.5 | v61.91,83.19 57.78,83.19 57.78,84.77 S1.1 | R1.2 54.13,69.37 v54.13,81.28
  Bottom 0.381: v32.07,63.5 34.77,63.5 37.31,66.04 50.8,66.04 R1.2 | SV1.6 74.3,88.27 70.17,88.27 65.09,83.19 v61.91,83.19 | v54.13,81.28 57.63,84.77 S1.1
N$9  (via drill 0.51)
  Top 0.381: IC1.4 48.26,10.16 v54.29,10.16 | v83.34,10.79 84.45,11.91 84.45,41.91 v85.41,42.86 | v88.58,44.77 88.27,45.09 88.27,66.52 89.22,67.47 92.08,67.47 92.08,69.06 91.12,70.01 88.27,70.01 88.27,74.45 v88.58,74.77 | v85.41,76.52 83.82,78.11 IC3.6
  Bottom 0.381: v54.29,10.16 55.88,8.57 67.63,8.57 69.22,10.16 82.71,10.16 v83.34,10.79 | v85.41,42.86 86.68,42.86 v88.58,44.77 | v88.58,74.77 87.15,74.77 v85.41,76.52
N$10  (via drill 0.51)
  Top 0.381: V3.18 29.37,39.21 29.37,40.8 29.05,41.12 v29.05,43.5
  Bottom 0.381: v29.05,43.5 26.19,43.5 18.73,50.96 13.81,50.96 V1.2 SV2.8
N$11  (via drill 0.51)
  Top 0.381: v43.34,23.18 43.18,23.34 IC2.3 | SV5.6 20.48,91.28 20.48,73.66 21.75,72.39 21.75,58.9 24.29,56.36 24.29,50.64 v27.15,47.78 | v38.58,45.24 39.21,44.61 v39.21,32.86
  Bottom 0.381: IC1.3 43.18,17.94 44.29,19.05 44.29,22.23 v43.34,23.18 | v27.15,47.78 27.46,47.78 30,45.24 v38.58,45.24 | v39.21,32.86 40.8,32.86 IC2.3
N$12  (via drill 0.51)
  Top 0.381: v26.99,31.43 26.67,31.11 26.67,23.02 v27.78,21.91 | v85.25,44.13 83.66,42.55 83.66,37.62 v82.07,36.04 | v47.15,23.65 v49.69,26.19
  Bottom 0.381: v26.99,31.43 V3.4 | v27.78,21.91 29.05,21.91 30.48,20.48 35.88,20.48 39.53,24.13 44.29,24.13 45.96,22.46 | 45.96,22.46 47.15,21.27 47.15,13.81 IC1.5 | LED23.A 95.25,58.74 98.9,55.09 98.9,52.86 94.77,48.74 86.36,48.74 84.93,47.31 84.93,46.67 84.45,46.2 84.45,44.93 v85.25,44.13 | v82.07,36.04 77.47,36.04 75.72,34.29 63.98,34.29 55.88,26.19 v49.69,26.19 | 45.96,22.46 v47.15,23.65
N$13  (via drill 0.51)
  Top 0.381: V3.5 22.07,29.69 v22.07,21.27 | v31.11,10.48 33.34,8.26 43.18,8.26 v43.18,8.41 | v49.69,11.11 50.01,11.11 50.32,10.79 53.34,10.79 IC1.7 | v84.93,60.64 84.93,51.75 82.39,49.21 v82.39,44.13 | v82.39,41.59 81.12,40.32 81.12,28.1 76.2,23.18 76.2,16.51 75.09,15.4 v66.36,15.4
  Bottom 0.381: v22.07,21.27 23.18,20.16 27.94,20.16 31.11,16.99 v31.11,10.48 | v43.18,8.41 45.56,10.79 49.37,10.79 v49.69,11.11 49.69,13.97 51.12,15.4 v66.36,15.4 | LED24.A 89.06,64.77 v84.93,60.64 | v82.39,41.59 v82.39,44.13
N$14  (via drill 0.51)
  Top 0.381: IC2.4 44.61,31.59 44.61,39.85 v49.85,45.09 | v69.69,62.39 v69.69,57.94
  Bottom 0.381: v49.85,45.09 58.42,45.09 67.31,53.98 69.06,53.98 69.69,54.61 v69.69,57.94 | v69.69,62.39 69.69,63.34 IC4.2
N$15  (via drill 0.51)
  Top 0.381: IC2.10 53.34,49.37 50.96,51.75 50.96,64.45 54.77,68.26 54.77,77.63 v55.4,78.26
  Bottom 0.381: v55.4,78.26 56.67,78.26 57.31,78.9 67.94,78.9 73.5,84.45 74.3,84.45 IC3.12
N$16  (via drill 0.51)
  Top 0.381: LED27.A 92.08,76.2 92.08,79.06 88.11,83.03 88.11,93.5 83.03,98.58 49.53,98.58 49.53,85.57 44.77,80.8 44.77,70.01 45.09,69.69 45.09,53.66 v42.7,51.28 | v34.61,46.2 33.66,45.24 v33.66,27.46
  Bottom 0.381: V3.8 29.21,24.13 30.64,25.56 33.66,25.56 | 33.66,25.56 36.67,25.56 38.58,27.46 43.66,27.46 44.77,28.57 46.35,28.57 IC2.5 | v42.7,51.28 41.12,51.28 36.04,46.2 v34.61,46.2 | 33.66,25.56 v33.66,27.46
N$17  (via drill 0.51)
  Top 0.381: V3.9 26.04,23.5 26.04,36.83 v26.99,37.78 | v47.31,35.72 48.74,35.72 v49.21,36.2 | v46.99,46.99 43.97,43.97 v43.97,42.07
  Bottom 0.381: v26.99,37.78 28.42,37.78 30.48,35.72 v47.31,35.72 | v49.21,36.2 51.44,36.2 51.83,35.8 | 51.83,35.8 52.23,35.4 52.23,33.18 53.34,32.07 IC2.7 | LED28.A 93.66,80.01 94.77,81.12 95.73,81.12 98.9,77.95 98.9,71.28 96.36,68.74 96.36,68.1 95.41,67.15 88.58,67.15 81.76,60.33 70.64,60.33 63.34,53.02 63.34,50.96 59.37,46.99 57.47,46.99 57.15,46.67 47.31,46.67 v46.99,46.99 | v43.97,42.07 48.26,42.07 50.32,40.01 51.28,40.01 51.91,39.37 51.91,35.88 51.83,35.8
N$18  (via drill 0.51)
  Top 0.381: LED21.A 94.14,54.45 94.14,67.47 LED25.A 95.25,68.74 93.98,70.01 v93.98,73.18 | IC1.11 50.64,20.48 50.64,28.26 49.69,29.21 49.69,33.81 50.32,34.45 50.32,37.62 IC2.11 50.8,47.31 v52.39,48.9 | v70.8,71.12 v72.23,69.69
  Bottom 0.381: V3.2 29.37,39.37 30.48,40.48 48.42,40.48 IC2.11 | v93.98,73.18 93.98,72.07 91.92,70.01 74.61,70.01 74.3,69.69 v72.23,69.69 | v70.8,71.12 70.8,70.64 65.72,65.56 65.72,61.75 58.26,54.29 58.26,52.07 55.09,48.9 v52.39,48.9
N$19  (via drill 0.51)
  Top 0.381: IC5.3 72.87,32.23 v72.87,37.31 | IC5.11 74.93,46.99 IC6.3 73.66,53.34 IC6.11 76.2,56.67 v73.5,59.37 | v62.39,88.74 67.15,83.98 67.15,66.36 71.6,61.91 v71.6,59.37
  Bottom 0.381: IC5.11 v72.87,37.31 | SV5.5 14.76,98.58 52.55,98.58 v62.39,88.74 | v73.5,59.37 v71.6,59.37
N$20  (via drill 0.51)
  Top 0.381: IC1.9 56.99,21.43 v56.99,34.92 56.99,41.27 v57.31,41.59 | v51.28,34.92 v53.18,34.92 | v49.37,34.92 47.94,34.92 47.47,34.45 v47.31,34.45 | v81.76,51.44 v83.34,53.02 | v75.25,50.16 v76.68,51.59
  Bottom 0.381: v53.18,34.92 v56.99,34.92 | v49.37,34.92 v51.28,34.92 | v47.31,34.45 34.29,34.45 33.02,33.18 28.89,33.18 25.24,36.83 V3.3 | LED22.A 87.47,57.15 v83.34,53.02 | v81.76,51.44 76.83,51.44 v76.68,51.59 | v75.25,50.16 65.88,50.16 v57.31,41.59
N$21  (via drill 0.51)
  Top 0.381: IC1.6 51.12,13.02 51.12,16.03 v52.23,17.14 | v87.31,31.59 87.63,31.91 87.63,67.94 87,68.58 87,76.99 87.47,77.47 87.47,85.25 IC3.8
  Bottom 0.381: v52.23,17.14 69.06,17.14 70.33,18.41 72.87,18.41 73.18,18.73 74.14,18.73 74.45,18.41 77.95,18.41 78.9,19.37 78.9,23.18 v87.31,31.59
N$22  (via drill 0.51)
  Top 0.381: V1.17 20.95,52.7 20.95,55.56 v21.75,56.36 | v63.5,67.63 65.88,67.63 65.88,62.23 67.47,60.64 67.47,46.99 69.69,44.77 71.44,44.77 v71.44,42.86
  Bottom 0.381: v21.75,56.36 28.26,56.36 31.27,59.37 32.23,59.37 32.54,59.05 33.5,59.05 34.45,60.01 34.45,62.23 37.62,65.41 56.04,65.41 58.1,67.47 63.34,67.47 v63.5,67.63 | v71.44,42.86 72.71,42.86 R10.1
N$23  (via drill 0.51)
  Top 0.381: v52.07,31.91 52.23,31.75 52.23,29.21 v53.82,27.62 | v80.49,44.13 80.17,44.45 80.17,52.39 82.39,54.61 82.39,63.82 81.12,65.09 81.12,76.52 80.17,77.47 80.17,84.45 81.28,85.57 IC3.10
  Bottom 0.381: IC2.12 48.26,34.61 50.48,32.38 51.59,32.38 v52.07,31.91 | v53.82,27.62 56.36,27.62 63.98,35.24 75.72,35.24 78.9,38.42 78.9,42.55 v80.49,44.13
N$24  (via drill 0.51)
  Top 0.381: v42.7,53.82 44.13,55.24 v44.13,69.06 | v68.1,74.45 68.42,74.14 68.42,70.33 70.8,67.94 73.82,67.94 73.82,64.61 76.2,62.23 R11.1
  Bottom 0.381: V1.18 19.84,52.07 21.75,50.16 31.91,50.16 32.54,49.53 38.42,49.53 v42.7,53.82 | v44.13,69.06 44.45,69.06 51.59,76.2 55.09,76.2 56.83,74.45 v68.1,74.45
N$25  (via drill 0.51)
  Top 0.381: V1.15 26.51,44.45 v26.51,44.61 | v45.72,44.29 48.58,47.15 v48.58,47.62 | v57.94,47.94 58.9,46.99 v58.9,33.02 | v67.47,41.91 72.39,41.91 R7.1
  Bottom 0.381: v26.51,44.61 37.78,44.61 38.1,44.29 v45.72,44.29 | v48.58,47.62 48.9,47.62 49.21,47.31 56.83,47.31 57.47,47.94 v57.94,47.94 | v58.9,33.02 58.9,33.34 v67.47,41.91
N$27
  Bottom 0.381: IC6.12 73.66,57.63 75.72,59.69 78.74,59.69 R11.2
N$28  (via drill 0.51)
  Top 0.381: IC6.5 79.53,47.47 79.53,43.66 80.01,43.18 83.34,43.18 83.34,43.66 v85.41,45.72 | SV4.4 40.48,7.46 45.56,7.46 45.56,10.48 44.61,11.43 44.61,19.05 45.72,20.16 IC1.13 46.2,20.8 46.2,28.57 46.83,29.21 46.83,33.5 45.72,34.61 IC2.13 45.72,38.26 47.62,40.16 47.62,41.91 v49.85,41.91 | v67.47,43.81 v69.53,43.81
  Bottom 0.381: v85.41,45.72 91.44,45.72 LED4.A | IC6.5 78.74,46.51 76.04,43.81 v69.53,43.81 | v67.47,43.81 67.15,43.81 66.52,44.45 61.59,44.45 57.78,40.64 51.12,40.64 v49.85,41.91
N$29  (via drill 0.51)
  Top 0.381: IC2.6 51.12,30.8 51.12,32.38 52.7,33.97 54.13,33.97 54.13,35.4 53.34,36.2 52.23,36.2 v52.23,41.59 | v70.96,53.34 72.55,54.93 72.55,61.59 v73.98,63.02
  Bottom 0.381: v52.23,41.59 53.34,41.59 53.5,41.43 55.72,41.43 67.63,53.34 v70.96,53.34 | v73.98,63.02 74.45,63.02 IC4.4
N$30
  Bottom 0.381: RN1.4 90.17,16.51 LED18.K
N$31
  Bottom 0.381: RN1.2 87.63,21.59 LED20.K
N$32  (via drill 0.51)
  Top 0.381: V3.19 29.84,41.27 29.84,42.86 30,43.02 v30,46.67 | v27.15,49.21 26.83,49.53 26.83,62.23 v27.94,63.34 | v30.32,64.45 30.32,77.79 23.81,84.3 v23.81,84.93 | v13.97,88.58 13.81,88.74 13.81,93.19 v12.86,94.14
  Bottom 0.381: v30,46.67 29.69,46.67 v27.15,49.21 | v27.94,63.34 29.21,63.34 v30.32,64.45 | v23.81,84.93 17.62,84.93 v13.97,88.58 | v12.86,94.14 10,94.14 8.89,95.25 8.89,97.79 8.1,98.58 4.6,98.58 SV5.1
N$33
  Top 0.381: IC3.1 76.2,83.82 79.53,83.82 79.53,84.77 80.17,85.41 80.17,88.74 82.39,90.96 82.39,96.36 SV3.1
N$34  (via drill 0.51)
  Top 0.381: v76.2,81.92 IC3.3 | v77.63,89.06 80.01,91.44 SV3.2
  Bottom 0.381: v76.2,81.92 76.2,83.98 77.63,85.41 v77.63,89.06
N$35
  Bottom 0.381: IC3.5 81.28,81.44 84.93,85.09 84.93,87.63 82.23,90.33 80.8,90.33 80.01,91.12 80.01,93.98 SV3.3
N$36
  Bottom 0.381: IC3.9 79.38,90.81 79.38,93.03 77.95,94.46 76.99,94.46 SV3.4
N$37
  Bottom 0.381: IC3.11 78.74,92.71 77.63,93.82 75.09,93.82 SV3.5
N$38  (via drill 0.51)
  Top 0.381: IC3.7 86.36,67.31 IC4.7 85.09,65.88 85.88,65.09 85.88,48.26 | R17.1 R12.1 88.9,35.4 88.27,34.77 88.27,31.11 86.52,29.37 86.36,29.37 | 85.88,48.26 86.36,48.26 R18.1 R16.1 86.36,29.37 | 85.88,48.26 IC6.7 | V2.9 V2.8 | RN1.1 86.36,29.37 | IC1.8 54.77,13.81 54.77,26.19 55.88,27.3 IC2.8 | R14.1 IC13.7 62.23,53.5 60.8,54.93 60.8,66.52 57.78,69.53 S3.1 57.78,69.69 57.78,72.55 S2.3 57.78,72.71 59.21,74.14 59.21,78.74 57.78,80.17 S1.3 | V3.10 24.13,20.32 V4.8 V4.9 | 5.71,64.14 IC8.1 | 5.71,64.14 7.46,64.14 7.46,46.67 7.3,46.51 7.3,42.39 8.26,41.43 8.26,36.35 10.16,34.45 V1.10 | IC1.2 38.73,10.79 35.72,10.79 35.72,26.51 v36.99,27.78 | IC7.1 29.21,71.12 IC7.6 29.21,77.31 v25.88,80.64 | C2.2 C1.2 C3.2 41.91,82.39 39.37,79.85 C4.1 41.91,76.2 C5.2 41.91,54.77 v41.43,54.29 41.75,54.45 41.75,36.83 41.43,36.51 41.43,31.27 IC2.2 | SV5.3 7.62,94.46 4.45,94.46 1.43,91.44 1.43,68.58 5.71,64.29 5.71,64.14
  Bottom 0.381: RN2.1 88.9,76.2 IC3.7 R15.1 | IC5.7 84.14,31.75 87.95,35.56 R12.1 | RN1.1 85.09,24.13 81.28,20.32 V2.9 | SV1.4 67.15,86.2 63.5,86.2 57.63,80.33 S1.3 57.47,80.33 44.13,80.33 C3.2 | IC2.8 54.45,31.91 54.45,33.02 55.4,33.97 57.47,33.97 62.23,38.73 R14.1 | IC4.7 80.01,60.96 69.85,60.96 IC13.7 | V1.10 10.16,32.86 11.27,31.75 16.51,31.75 V4.9 | IC9.1 23.42,83.11 | 23.42,83.11 22.86,82.55 IC11.7 17.78,82.71 11.59,88.9 11.59,91.12 7.62,95.09 SV5.3 | v36.99,27.78 37.94,27.78 IC2.2 | IC10.7 40.48,53.34 v41.43,54.29 | IC7.6 34.29,78.74 C4.1 | v25.88,80.64 23.42,83.11
N$39
  Top 0.381: IC3.13 73.66,92.71 SV3.6
N$40  (via drill 0.51)
  Top 0.381: v23.81,70.01 25.56,71.75 25.56,74.93 v26.35,75.72 | v34.77,80.96 34.13,81.6 34.13,85.72 36.83,88.42 36.83,89.53 38.73,91.44 40.64,91.44 40.64,83.82 C3.1
  Bottom 0.381: IC8.7 IC8.6 9.05,69.85 10.95,67.94 21.75,67.94 v23.81,70.01 | R6.1 43.81,86.36 40.01,82.55 C3.1 | v26.35,75.72 29.53,75.72 v34.77,80.96
N$41  (via drill 0.51)
  Top 0.381: v82.07,68.74 83.66,70.33 83.66,76.52 82.71,77.47 82.71,82.87 84.93,85.09 84.93,91.6 v83.34,93.19
  Bottom 0.381: IC4.1 72.55,68.74 v82.07,68.74 | v83.34,93.19 81.28,95.25 81.28,97.79 80.49,98.58 69.37,98.58 SV3.7
N$42  (via drill 0.51)
  Top 0.381: IC4.3 74.77,66.2 74.77,71.44 73.5,72.71 73.5,74.93 v72.55,75.88 | v69.06,75.88 67.79,77.15 67.79,85.72 65.72,87.79 65.72,89.85 66.04,90.17 66.04,95.25 SV3.8
  Bottom 0.381: v69.06,75.88 v72.55,75.88
N$43  (via drill 0.51)
  Top 0.381: v31.75,68.9 IC7.4 | v45.72,73.98 46.99,75.25 46.99,77.47 R2.1 | v63.98,93.5 56.2,85.72 56.2,78.74 57.63,77.31 S2.1
  Bottom 0.381: v31.75,68.9 40.64,68.9 v45.72,73.98 | SV1.5 72.87,93.5 v63.98,93.5 | R2.1 50.32,78.74 51.75,77.31 57.63,77.31 S2.1
N$44  (via drill 0.51)
  Top 0.381: IC10.2 25.72,53.66 v25.72,58.9 | v81.28,91.28 77.31,87.31 77.31,85.09 76.68,84.45 72.23,84.45 72.23,87.63 71.6,88.27 v66.67,88.27 | v45.24,83.82 43.81,82.39 43.81,78.58 v42.39,77.15 | v29.37,69.85 29.21,69.69 IC7.3
  Bottom 0.381: v25.72,58.9 26.83,60.01 26.83,63.66 | IC7.3 26.83,63.66 | IC11.3 7.62,78.42 12.54,73.5 12.54,72.55 11.75,71.75 5.87,71.75 5.24,71.12 5.24,68.58 7.78,66.04 21.75,66.04 24.13,63.66 26.83,63.66 | LED7.A 92.71,88.42 96.36,92.08 96.36,93.19 95.73,93.82 85.41,93.82 82.87,91.28 v81.28,91.28 | v66.67,88.27 63.34,88.27 61.28,86.2 53.66,86.2 51.28,83.82 v45.24,83.82 | v42.39,77.15 39.05,77.15 31.75,69.85 v29.37,69.85
N$45  (via drill 0.51)
  Top 0.381: v18.89,69.85 19.68,70.64 v19.68,73.03 | v28.26,76.83 v25.88,79.22 | v35.08,82.71 37.47,85.09 37.47,88.27 C2.1
  Bottom 0.381: v18.89,69.85 IC8.5 | v25.88,79.22 v19.68,73.03 | v28.26,76.83 29.21,76.83 v35.08,82.71
N$46  (via drill 0.51)
  Top 0.381: v14.29,54.61 14.13,54.77 14.13,74.61 v13.65,75.09 | v9.05,79.69 9.05,93.98 10.16,95.09 SV5.4
  Bottom 0.381: v14.29,54.61 V1.19 | v9.05,79.69 v13.65,75.09
N$47  (via drill 0.51)
  Top 0.381: v30.48,56.2 IC10.4
  Bottom 0.381: v30.48,56.2 44.13,56.2 IC13.1
N$48  (via drill 0.51)
  Top 0.381: v28.42,57.94 30.16,57.94 30.64,58.42 v31.75,58.42 | R5.1 50.16,80.64 50.16,70.96 46.99,67.79 46.99,64.77 v47.31,64.45
  Bottom 0.381: IC8.2 6.35,63.02 8.73,65.41 20.8,65.41 24.29,61.91 24.29,58.9 25.24,57.94 v28.42,57.94 | v31.75,58.42 35.4,58.42 36.99,60.01 36.99,62.23 39.53,64.77 47.31,64.77 | 47.31,64.77 57.47,64.77 57.63,64.93 S3.3 | v47.31,64.45 47.31,64.77
N$49  (via drill 0.51)
  Top 0.381: V1.16 21.75,50.96 21.75,54.93 v21.91,55.09 | v49.69,48.26 v47.78,50.16 | v61.91,55.4 63.98,55.4 63.98,32.7 68.74,27.94 R9.1
  Bottom 0.381: v21.91,55.09 22.23,55.09 22.38,55.24 42.7,55.24 v47.78,50.16 | v49.69,48.26 51.59,48.26 51.91,47.94 56.52,47.94 60.01,51.44 60.17,51.44 61.12,52.39 61.12,54.61 v61.91,55.4
N$50  (via drill 0.51)
  Top 0.381: v29.69,13.34 31.75,15.4 V3.11 | v9.05,32.38 9.05,13.97 9.68,13.34 15.24,13.34 V5.15
  Bottom 0.381: V5.15 17.14,13.34 v29.69,13.34 | SV2.1 4.6,36.83 v9.05,32.38
N$51  (via drill 0.51)
  Top 0.381: V5.16 14.61,17.14 16.35,17.14 | v16.99,17.14 16.35,17.14 | v29.69,16.99 29.84,17.14 29.84,19.68 V3.12 | v8.1,31.59 v8.1,35.08 | v5.24,31.59 3.65,30 3.65,25.08 2.38,23.81 v2.38,22.54 | v4.13,10.95 6.51,8.57 6.51,6.35 7.14,5.71 16.35,5.71 16.35,17.14
  Bottom 0.381: v16.99,17.14 29.53,17.14 v29.69,16.99 | v8.1,35.08 SV2.2 | v5.24,31.59 v8.1,31.59 | v2.38,22.54 1.43,21.59 1.43,13.65 v4.13,10.95
N$52  (via drill 0.51)
  Top 0.381: V5.17 14.13,19.21 v14.13,21.91 | v3.33,23.34 3.97,22.7 3.97,13.97 8.41,9.53 v11.11,9.53
  Bottom 0.381: v14.13,21.91 14.45,21.91 15.56,23.02 29.05,23.02 30.16,24.13 V3.13 | SV2.3 1.43,39.53 1.43,25.24 v3.33,23.34 | v11.11,9.53 10.79,9.84 10.64,9.84 10.16,10.32 V5.17
N$53  (via drill 0.51)
  Top 0.381: V5.18 8.41,14.45 8.41,13.49 v11.11,10.79 | v29.69,10.79 33.66,14.76 33.66,24.77 V3.14 | v11.75,32.7 11.27,32.23 v11.27,17.78
  Bottom 0.381: v29.69,10.79 v11.11,10.79 11.27,10.95 v11.27,17.78 | SV2.4 5.24,44.45 9.21,40.48 11.43,40.48 12.06,39.85 12.06,33.02 v11.75,32.7
N$54  (via drill 0.51)
  Top 0.381: LED18.A 94.14,20.16 94.14,16.67 98.9,11.91 98.9,7.94 93.66,2.7 v76.36,2.7 | v29.69,26.04 29.84,25.88 29.84,23.34 v30.32,22.86 | v58.9,23.97 59.21,23.65 v59.21,5.56
  Bottom 0.381: V5.3 7.62,12.86 6.51,13.97 6.51,24.29 V4.13 10.32,27.94 12.22,29.84 15.72,29.84 16.67,28.89 16.67,26.67 17.78,25.56 29.21,25.56 v29.69,26.04 | v76.36,2.7 65.09,2.7 61.91,5.87 59.21,5.87 | 59.21,5.87 54.13,5.87 SV7.6 | v30.32,22.86 34.92,22.86 37.47,25.4 49.05,25.4 50.48,23.97 v58.9,23.97 | v59.21,5.56 59.21,5.87
N$55  (via drill 0.51)
  Top 0.381: v12.7,12.38 V5.5 | v80.8,22.23 78.58,22.23 78.58,6.35 76.04,3.81 SV7.8 57.31,3.97 57.31,20.8 57.94,21.43 57.94,33.5 58.26,33.81 58.26,45.72 v57.94,46.04 | V4.11 15.24,60.96 16.03,61.75 v16.03,63.02 | v12.54,63.82 7.46,68.9 7.46,80.33 6.51,81.28 6.51,92.39 8.89,94.77 8.89,97.79 9.68,98.58 24.13,98.58 24.13,88.74 26.83,86.04 26.83,82.39 40.48,68.74 40.48,47.15 v40.8,46.83
  Bottom 0.381: v12.7,12.38 12.7,12.86 13.81,13.97 13.81,16.83 11.59,19.05 11.59,24.29 V4.11 | LED20.A 87.79,29.21 v80.8,22.23 | v16.03,63.02 15.72,63.02 14.92,63.82 v12.54,63.82 | v40.8,46.83 41.91,46.83 42.7,46.04 v57.94,46.04
N$56  (via drill 0.51)
  Top 0.381: v73.66,17.78 71.75,17.78 71.75,18.57 70.96,19.37 70.96,22.23 59.85,33.34 59.85,47.15 61.59,48.9 61.59,49.85 61.12,50.32 56.83,50.32 v56.83,44.13 | v14.29,49.53 13.97,49.21 v13.97,30.8 | SV7.5 49.37,3.97 49.37,9.05 48.9,9.53 v46.51,9.53 | v44.61,8.41 42.86,10.16 34.61,10.16 v34.61,42.86
  Bottom 0.381: V5.2 5.08,12.86 3.97,13.97 3.97,21.59 5.87,23.5 5.87,25.24 7.62,26.99 V4.14 7.78,27.94 10.64,30.8 v13.97,30.8 | LED17.A 92.39,17.78 90.01,15.4 80.64,15.4 78.26,17.78 v73.66,17.78 | v56.83,44.13 54.77,42.07 53.82,42.07 52.86,43.02 34.61,43.02 | 34.61,43.02 30,43.02 29.53,42.55 25.88,42.55 20,48.42 15.4,48.42 v14.29,49.53 | v46.51,9.53 45.72,9.53 v44.61,8.41 | v34.61,42.86 34.61,43.02
N$57  (via drill 0.51)
  Top 0.381: V5.19 6.19,16.35 v6.19,55.56 | v8.41,55.56 8.26,55.72 8.26,57.63 10.95,60.33 v12.38,60.33 | v16.19,60.33 16.99,61.12 16.99,74.61 v19.53,77.15 | v21.43,79.06 21.43,95.41 SV5.8
  Bottom 0.381: v8.41,55.56 v6.19,55.56 | v16.19,60.33 v12.38,60.33 | v21.43,79.06 v19.53,77.15
N$58  (via drill 0.51)
  Top 0.381: v13.02,58.1 13.18,57.94 v13.18,56.2
  Bottom 0.381: v13.02,58.1 IC8.3 | v13.18,56.2 16.35,56.2 16.83,55.72 19.05,55.72 21.75,53.02 21.75,52.07 22.38,51.44 33.66,51.44 IC10.6
N$59
  Top 0.381: 30.4,87.55 30.48,87.63 IC9.6 | 30.4,87.55 IC9.2 | 30.4,87.55 31.91,86.04 31.91,82.23 39.21,74.93 C5.1
  Bottom 0.381: R3.1 43.81,74.93 42.55,76.2 40.64,76.2 C5.1
N$60  (via drill 0.51)
  Top 0.381: v94.46,33.18 96.36,35.08 96.36,42.07 LED3.A | IC1.14 42.07,21.43 42.07,36.2 43.18,37.31 IC2.14 43.18,39.85 v47.31,43.97 | v63.18,32.07 60.8,34.45 v60.8,38.73 | v54.77,39.69 54.29,40.16 v54.29,43.02
  Bottom 0.381: v94.46,33.18 86.52,33.18 83.19,29.84 79.38,29.84 IC5.5 77.31,31.75 75.41,33.66 64.77,33.66 v63.18,32.07 | SV4.3 42.07,11.59 42.07,19.21 IC1.14 | v60.8,38.73 57.63,38.73 56.36,40.01 55.09,40.01 v54.77,39.69 | v54.29,43.02 53.82,43.02 52.86,43.97 v47.31,43.97
N$61  (via drill 0.51)
  Top 0.381: v48.58,76.36 49.53,75.41 49.53,72.39 R8.1
  Bottom 0.381: IC9.7 27.94,91.12 32.07,87 33.5,87 38.1,82.39 38.1,81.92 40.01,80.01 43.5,80.01 47.15,76.36 v48.58,76.36 | R8.1 R3.2
N$62
  Top 0.381: IC9.5 43.18,92.71 43.18,80.01 C4.2
N$63  (via drill 0.51)
  Top 0.381: LED5.K LED6.K | v66.04,60.64 R14.2
  Bottom 0.381: v66.04,60.64 66.04,61.12 68.74,63.82 68.74,67.63 73.82,72.71 73.82,74.93 75.09,76.2 83.66,76.2 85.25,77.79 85.25,81.92 95.25,91.92 LED6.K
N$64  (via drill 0.51)
  Top 0.381: IC10.1 22.86,56.83 20.64,59.05 v20.64,71.91 | v30.8,81.28 30.48,81.6 IC9.3
  Bottom 0.381: v20.64,71.91 23.5,71.91 23.65,71.75 24.61,71.75 25.4,72.55 25.4,76.36 30.32,81.28 v30.8,81.28
N$65  (via drill 0.51)
  Top 0.381: v23.65,80.01 28.1,75.56 v28.1,72.07 | v31.27,70.8 35.56,66.52 IC10.9
  Bottom 0.381: IC11.2 6.99,84.45 13.18,84.45 14.13,83.5 14.13,81.28 15.4,80.01 v23.65,80.01 | v28.1,72.07 28.42,72.07 29.69,70.8 v31.27,70.8
N$66  (via drill 0.51)
  Top 0.381: v33.02,50.48 IC10.5 | v19.68,53.18 19.68,67.63 17.94,69.37 v17.94,71.75
  Bottom 0.381: v33.02,50.48 32.54,50.48 32.23,50.8 22.07,50.8 v19.68,53.18 | v17.94,71.75 17.94,72.23 10.16,80.01 IC11.4
N$67  (via drill 0.51)
  Top 0.381: v13.97,85.09 11.27,85.09 11.27,74.14 10.32,73.18 10.32,67.47 13.49,64.29 13.49,60.01 12.06,58.58 12.06,33.81 13.02,32.86 13.02,30 14.13,28.89 14.13,23.81 16.67,21.27 16.67,18.89 19.21,16.35 19.21,13.65 24.13,8.73 SV6.3 | v61.12,4.92 61.12,9.05 V2.2 64.93,12.7 v69.85,7.78 | v58.58,2.38 58.26,2.38 57.63,1.75 27.78,1.75 v27.78,2.06 | LED5.A 93.98,96.52 93.98,82.87 98.9,77.95 98.9,30.64 89.69,21.43 v89.69,9.84
  Bottom 0.381: IC11.6 15.24,83.82 v13.97,85.09 | v58.58,2.38 v61.12,4.92 | v27.78,2.06 27.46,2.06 27.15,1.75 26.19,1.75 SV6.3 | v89.69,9.84 87.63,7.78 v69.85,7.78
N$68  (via drill 0.51)
  Top 0.381: v32.7,67.94 33.02,67.63 IC10.10 33.02,58.26 31.91,57.15 31.91,52.07 29.05,49.21 v28.57,49.21 | v55.72,73.82 v57.31,75.41 | SV6.4 28.73,5.87 28.73,40.48 28.1,41.12 28.1,46.2 29.84,47.94 v30.16,47.94
  Bottom 0.381: IC11.5 12.7,78.42 20.16,70.96 26.83,70.96 29.84,67.94 v32.7,67.94 32.7,68.1 46.99,68.1 52.7,73.82 v55.72,73.82 | LED6.A 92.71,90.33 82.39,80.01 82.39,77.47 81.76,76.83 67.79,76.83 66.36,75.41 v57.31,75.41 | v30.16,47.94 29.84,47.94 v28.57,49.21
N$69
  Bottom 0.381: SV2.7 V1.3 10.16,51.91 13.97,48.1 13.97,40.8 16.51,38.26 25.08,38.26 29.05,34.29 V3.17
N$70  (via drill 0.51)
  Top 0.381: V2.14 60.17,13.18 v60.17,7.62
  Bottom 0.381: SV7.1 42.07,6.51 44.13,6.51 45.24,7.62 v60.17,7.62 65.09,7.62 66.83,5.87 74.61,5.87 77.95,2.54 LED13.A
N$71  (via drill 0.51)
  Top 0.381: V2.13 70.33,19.84 70.33,17.94 v70.8,17.46 | v73.82,14.45 v73.82,6.83 73.66,6.83 73.66,6.51 v64.77,6.51
  Bottom 0.381: v73.82,14.45 v70.8,17.46 | v73.82,6.83 83.5,6.83 85.09,5.24 91.6,5.24 LED14.A | SV7.2 43.97,5.87 53.18,5.87 53.82,6.51 v64.77,6.51
N$72  (via drill 0.51)
  Top 0.381: v77.95,23.5 82.39,23.5 82.39,10.32 84.93,7.78 95.25,7.78 LED15.A
  Bottom 0.381: LED15.A 95.25,7.94 98.9,4.29 98.9,2.06 98.27,1.43 46.83,1.43 SV7.3 | V2.12 72.39,21.11 74.77,23.5 v77.95,23.5
N$73  (via drill 0.51)
  Top 0.381: V2.1 66.04,16.51 74.93,16.51 74.93,16.83 | V2.11 74.93,16.83 | v75.09,16.83 74.93,16.83 | SV7.4 48.42,5.24 v48.42,8.57
  Bottom 0.381: LED16.A 91.44,13.97 90.33,12.86 82.23,12.86 78.26,16.83 v75.09,16.83 | v48.42,8.57 49.05,8.57 52.23,11.75 52.23,13.97 52.86,14.61 60.33,14.61 V2.1
N$74
  Bottom 0.381: IC10.8 44.45,60.96 IC13.3
N$75
  Bottom 0.381: V3.16 29.37,31.75 25.4,35.72 16.51,35.72 13.34,38.89 13.34,46.35 V1.4 SV2.6
N$76  (via drill 0.51)
  Top 0.381: IC10.3 29.53,54.93 29.53,56.67 30.16,57.31 v30.96,57.31
  Bottom 0.381: v30.96,57.31 45.56,57.31 IC13.2
N$77
  Bottom 0.381: V3.15 26.51,29.21 25.4,28.1 22.54,28.1 17.46,33.18 16.51,33.18 12.7,36.99 12.7,44.45 V1.5 SV2.5
N$78  (via drill 0.51)
  Top 0.381: IC4.14 70.01,73.82 70.01,85.25 IC3.14 | R4.2 R6.2 R5.2 R2.2 52.07,78.58 50.8,77.31 50.8,70.01 50.88,69.93 | IC13.14 48.26,62.23 R1.1 48.42,67.31 48.42,67.47 50.88,69.93 | 50.88,69.93 R8.2 | V2.10 V2.7 | IC5.10 77.47,37.62 75.41,35.56 75.41,32.23 IC5.4 74.93,26.67 | v75.25,22.54 74.93,22.86 74.93,26.67 | IC6.14 IC6.1 | IC6.14 IC6.13 | IC5.13 IC5.14 67.31,36.51 | IC5.1 67.31,36.51 | 74.93,26.67 71.12,26.67 71.12,32.86 67.47,36.51 67.31,36.51 | v66.2,70.33 66.52,70.01 66.52,62.55 68.58,60.48 IC6.14 | IC8.8 3.65,70.01 3.65,89.06 IC11.14 | IC7.8 22.86,72.39 IC10.14 | V4.16 1.43,26.83 1.43,8.73 V5.1 2.7,7.62 8.57,1.75 25.4,1.75 25.4,5.24 26.51,6.35 26.51,9.21 21.43,14.29 21.43,16.51 17.78,20.16 V4.7 V4.10 17.78,28.1 21.11,31.43 21.11,38.89 22.62,40.4 | IC1.16 37.94,20.48 37.94,28.26 36.99,29.21 36.99,36.99 IC2.16 38.1,38.26 35.56,40.8 35.56,46.83 34.77,47.62 31.75,47.62 V3.20 | V3.1 22.62,40.4 | V1.20 15.88,55.24 15.88,41.43 16.83,40.48 22.54,40.48 22.62,40.4 | v35.72,88.74 33.02,86.04 IC9.4
  Bottom 0.381: IC4.14 68.74,73.66 66.2,71.12 | R8.2 66.2,71.12 | v75.25,22.54 V2.10 | IC6.4 76.2,50.64 74.85,51.99 | 74.85,51.99 71.12,55.72 IC6.13 | 74.85,51.99 IC6.10 | V2.16 62.23,26.67 IC5.1 | IC6.1 68.58,40.64 IC5.14 | v66.2,70.33 66.2,71.12 | SV5.2 5.08,92.71 IC11.14 | IC9.8 IC9.4 33.02,84.93 24.13,76.04 IC7.8 | IC10.14 21.75,60.96 17.94,57.15 V1.20 V1.1 7.94,57.15 5.24,59.85 5.24,63.18 3.81,64.61 IC8.8 | V3.20 V3.1 | R4.2 50.01,90.17 48.58,88.74 v35.72,88.74
N$79  (via drill 0.51)
  Top 0.381: v15.08,62.23 14.76,62.55 14.76,79.69 16.67,81.6 16.67,83.82 v18.73,85.88 | v27.3,89.38 29.21,91.28 29.21,97.79 30,98.58 46.99,98.58 46.99,91.44 R4.1
  Bottom 0.381: v15.08,62.23 IC8.4 | v18.73,85.88 23.81,85.88 v27.3,89.38
N$80
  Bottom 0.381: RN1.3 88.58,19.05 93.82,24.29 96.68,24.29 LED19.K
N$81  (via drill 0.51)
  Top 0.381: v3.65,34.45 1.75,36.35 1.75,55.24 v6.51,60.01 | v15.72,64.45 16.35,65.09 16.35,78.74 19.53,81.92 v19.53,83.5 | v22.38,83.5 22.86,83.98 SV5.9
  Bottom 0.381: V4.1 2.54,21.11 4.29,22.86 4.29,25.24 3.65,25.88 v3.65,34.45 | v6.51,60.01 7.78,61.28 7.78,63.5 9.05,64.77 15.4,64.77 v15.72,64.45 | v22.38,83.5 v19.53,83.5
N$82  (via drill 0.51)
  Top 0.381: v5.08,25.88 V4.2 | v7.14,41.12 v7.14,30.64 | v11.59,73.03 12.7,74.14 12.7,80.17 14.13,81.6 14.13,83.82 v17.14,86.84
  Bottom 0.381: v5.08,25.88 5.4,25.88 6.51,26.99 6.51,30 v7.14,30.64 | v7.14,41.12 5.08,43.18 2.54,43.18 1.75,43.97 1.75,70.17 4.6,73.03 v11.59,73.03 | v17.14,86.84 19.53,89.22 19.53,90.01 25.4,95.89 SV5.10
N$83  (via drill 0.51)
  Top 0.381: v65.41,32.7 66.36,33.66 v66.36,36.2 | v76.04,42.86 77.63,44.45 77.63,63.5 76.04,65.09 76.04,76.36 IC3.2
  Bottom 0.381: IC1.12 48.26,21.91 49.37,23.02 59.37,23.02 61.59,25.24 61.59,28.89 v65.41,32.7 | v66.36,36.2 71.91,36.2 72.07,36.04 73.98,36.04 76.04,38.1 v76.04,42.86
N$84  (via drill 0.51)
  Top 0.381: v27.62,26.67 27.94,26.99 27.94,40.16 27.46,40.64 27.46,46.67 29.69,48.9 39.53,48.9 v39.53,47.94 | v53.02,51.12 55.88,48.26 IC2.9 | v73.82,70.64 73.18,70.01 73.18,69.22 72.71,68.74 70.96,68.74 70.96,69.22 v69.37,70.8
  Bottom 0.381: v27.62,26.67 V3.7 | v39.53,47.94 42.07,47.94 43.34,49.21 51.12,49.21 v53.02,51.12 53.18,51.12 53.18,54.29 58.26,59.37 58.26,61.91 62.87,66.52 63.82,66.52 68.1,70.8 v69.37,70.8 | LED26.A 86.2,72.39 84.45,70.64 v73.82,70.64
N$85
  Bottom 0.381: RN1.5 90.49,13.97 93.19,16.67 96.68,16.67 LED17.K
N$86
  Bottom 0.381: RN1.6 92.71,11.43 LED16.K
N$87
  Top 0.381: RN1.7 94.14,8.89 94.14,10.64 94.77,11.27 97.79,11.27 LED15.K
N$88
  Top 0.381: RN1.8 91.6,6.35 91.6,5.87 92.23,5.24 95.25,5.24 LED14.K
N$89
  Bottom 0.381: RN1.9 96.52,3.81 LED13.K
N$90
  Top 0.381: R15.2 LED7.K
N$91  (via drill 0.51)
  Top 0.381: RN2.3 93.03,71.12 v93.03,68.74
  Bottom 0.381: v93.03,68.74 95.57,71.28 95.73,71.28 97.79,73.34 LED27.K
N$92
  Bottom 0.381: RN2.4 91.44,68.58 LED26.K
N$93
  Bottom 0.381: RN2.5 95.25,66.04 LED25.K
N$94
  Bottom 0.381: RN2.6 93.98,63.5 LED24.K
N$95
  Bottom 0.381: RN2.7 93.66,60.96 94.77,62.07 96.68,62.07 LED23.K
N$96
  Bottom 0.381: RN2.8 93.98,58.42 LED22.K
N$97
  Bottom 0.381: RN2.9 95.25,55.88 LED21.K
N$98
  Bottom 0.381: LED1.K 96.84,35.56 95.73,36.67 93.82,36.67 R12.2
N$99
  Bottom 0.381: LED2.K 94.3,39.37 93.19,40.48 91.28,40.48 R16.2
N$100
  Top 0.381: LED3.K 96.36,44.61 92.87,44.61 92.87,43.34 R17.2
N$101
  Bottom 0.381: LED4.K 94.3,46.99 93.19,48.1 91.28,48.1 R18.2
N$102
  Top 0.381: IC5.12 74.3,37.47 76.36,37.47 76.36,40.8 R10.2
N$103
  Bottom 0.381: R9.2 IC5.2
N$104
  Bottom 0.381: IC6.2 71.12,45.24 71.91,44.45 74.93,44.45 R7.2

### Text on the board
tPlace: CLK | RAM | ©Eric He 2020